# Altium project SENSEI_Base-Board.PrjPcb (part 2 of 3)

## Sheet 06_nRF_POWER_SWD_RF.SchDoc: SENSEI Base Board - nRF Power
size A3; DrawnBy: Sebastian Frey; Organization: Integrated Systems Laboratory; DocumentNumber: 7; Revision: v1.0; SheetNumber: 7; SheetTotal: 12
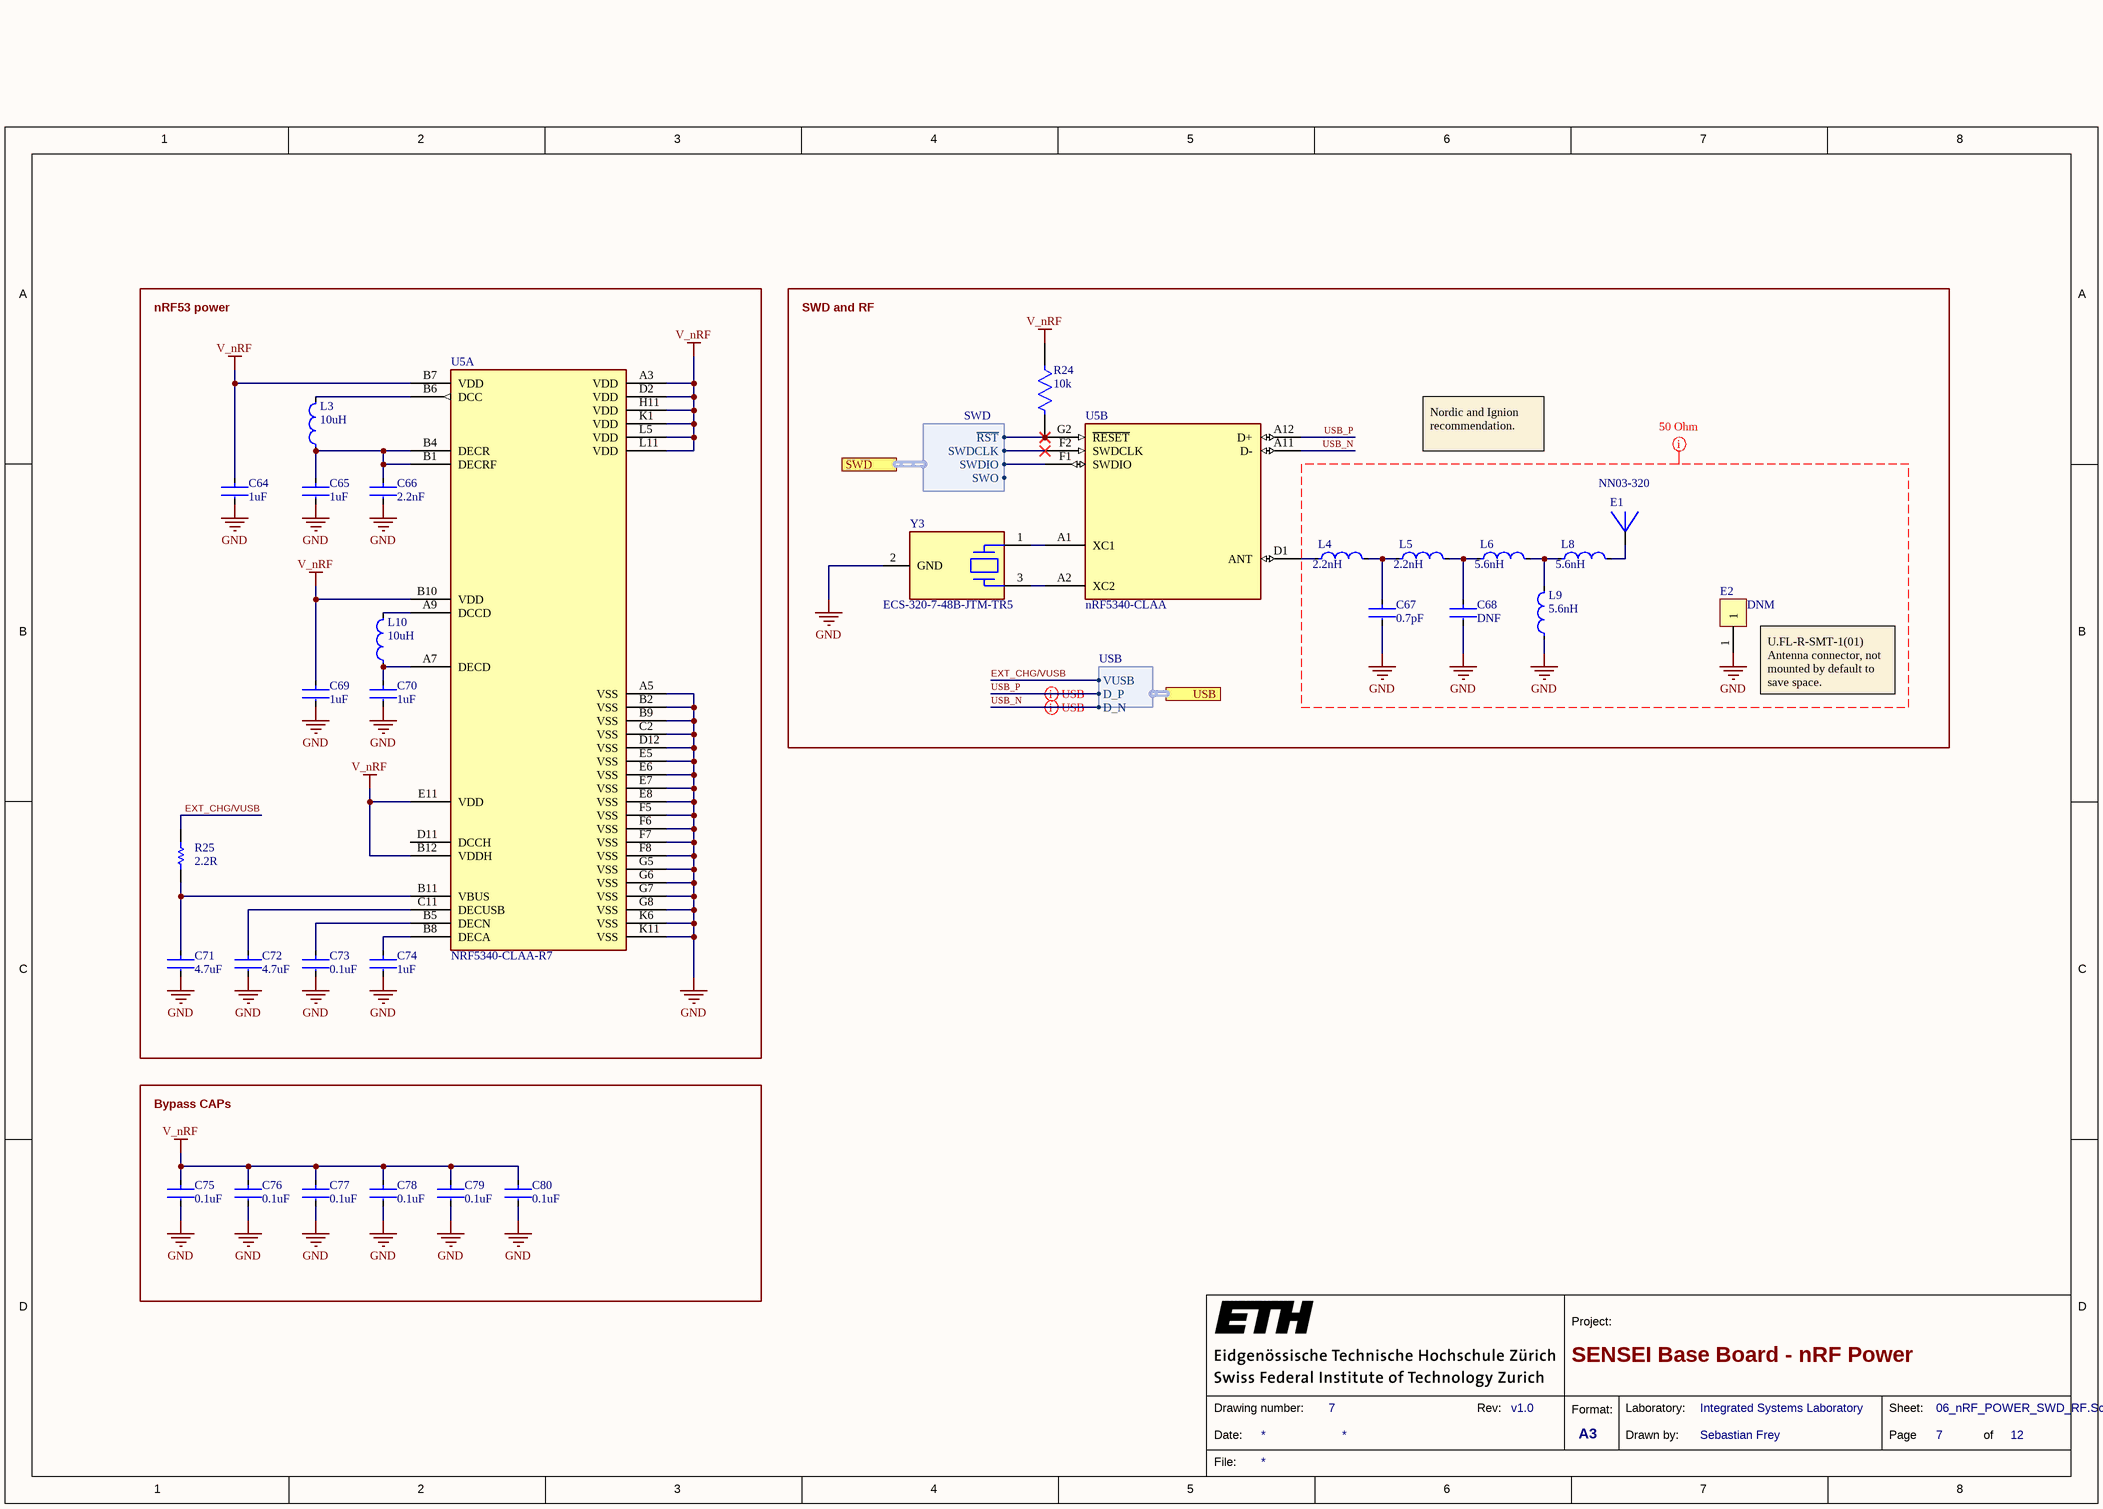
[diagram p6: 06_nRF_POWER_SWD_RF.SchDoc]

### Parts
C64  Capacitance: 1uF  [FP-CL03-IPC_B]  (hidden comment: CL03A105KP3NSNC)
C65  Capacitance: 1uF  [FP-CL03-IPC_B]  (hidden comment: CL03A105KP3NSNC)
C66  Capacitance: 2.2nF  [FP-GRM033-0_03-MFG]  (hidden comment: GRM033R71C222KA88D)
C67  Capacitance: 0.7pF  [FP-GJM033-0_03-IPC_C]  (hidden comment: GJM0335C1ER70BB01D)
C68  DNF  [FP-GRM033-0_03-MFG]
C69  Capacitance: 1uF  [FP-CL03-IPC_B]  (hidden comment: CL03A105KP3NSNC)
C70  Capacitance: 1uF  [FP-CL03-IPC_B]  (hidden comment: CL03A105KP3NSNC)
C71  Capacitance: 4.7uF  [FP-C1005-050-0_15-IPC_B]  (hidden comment: C1005X5R0J475K050BC)
C72  Capacitance: 4.7uF  [FP-C1005-050-0_15-IPC_B]  (hidden comment: C1005X5R0J475K050BC)
C73  Capacitance: 0.1uF  [FP-GRM033-0_03-IPC_B]  (hidden comment: GRM033Z71C104KE14D)
C74  Capacitance: 1uF  [FP-CL03-IPC_B]  (hidden comment: CL03A105KP3NSNC)
C75  Capacitance: 0.1uF  [FP-GRM033-0_03-IPC_B]  (hidden comment: GRM033Z71C104KE14D)
C76  Capacitance: 0.1uF  [FP-GRM033-0_03-IPC_B]  (hidden comment: GRM033Z71C104KE14D)
C77  Capacitance: 0.1uF  [FP-GRM033-0_03-IPC_B]  (hidden comment: GRM033Z71C104KE14D)
C78  Capacitance: 0.1uF  [FP-GRM033-0_03-IPC_B]  (hidden comment: GRM033Z71C104KE14D)
C79  Capacitance: 0.1uF  [FP-GRM033-0_03-IPC_B]  (hidden comment: GRM033Z71C104KE14D)
C80  Capacitance: 0.1uF  [FP-GRM033-0_03-IPC_B]  (hidden comment: GRM033Z71C104KE14D)
E1  NN03-320  [NN03-320]
E2  DNM  [U.FL-R-SMT-1(01)_GND_pad_small]
L3  Parameter 1: 10uH  [FP-LQM18DN_70-IPC_C]  (hidden comment: LQM18DN100M70L)
L4  Inductance: 2.2nH  [FP-LQP03HQ_02-MFG]  (hidden comment: LQP03HQ2N2B02D)
L5  Inductance: 2.2nH  [FP-LQP03HQ_02-MFG]  (hidden comment: LQP03HQ2N2B02D)
L6  Inductance: 5.6nH  [FP-LQW03AW_00-MFG]  (hidden comment: LQW03AW5N6J00D)
L8  Inductance: 5.6nH  [FP-LQW03AW_00-MFG]  (hidden comment: LQW03AW5N6J00D)
L9  Inductance: 5.6nH  [FP-LQW03AW_00-MFG]  (hidden comment: LQW03AW5N6J00D)
L10  Parameter 1: 10uH  [FP-LQM18DN_70-IPC_C]  (hidden comment: LQM18DN100M70L)
R24  Resistance: 10k  [FP-RMCF0201-IPC_C]  (hidden comment: RMCF0201FT10K0)
R25  value 2.2R  [RESC0201(0603)_L]  (hidden comment: RC0201FR-072R2L)
U5  NRF5340-CLAA-R7  [NRF5340_WLCSP]  (parts A,B of 3)
Y3  ECS-320-7-48B-JTM-TR5  [Y_ECX-1048]

### Blocks framed on the sheet
nRF53 power: C64-C66 C69-C74 L3 L10 R25 U5
SWD and RF: C67 C68 E1 E2 L4-L6 L8 L9 R24 U5 Y3
Bypass CAPs: C75-C80

### Ports
SWD (harness SWD), USB (harness USB)

### Harnesses
SWD: ~{RST}, SWDIO, SWDCLK, SWO
USB: VUSB, D_P, D_N

### Nets
GND: C64.2 C65.2 C66.2 C67.2 C68.2 C69.2 C70.2 C71.2 C72.2 C73.2 C74.2 C75.2 C76.2 C77.2 C78.2 C79.2 C80.2 E2.1 L9.1 U5.A5(VSS) U5.B2(VSS) U5.B9(VSS) U5.C2(VSS) U5.D12(VSS) U5.E5(VSS) U5.E6(VSS) U5.E7(VSS) U5.E8(VSS) U5.F5(VSS) U5.F6(VSS) U5.F7(VSS) U5.F8(VSS) U5.G5(VSS) U5.G6(VSS) U5.G7(VSS) U5.G8(VSS) U5.K6(VSS) U5.K11(VSS) Y3.2(GND)
V_nRF: C64.1 C69.1 C75.1 C76.1 C77.1 C78.1 C79.1 C80.1 R24.1 U5.A3(VDD) U5.B7(VDD) U5.B10(VDD) U5.B12(VDDH) U5.D2(VDD) U5.E11(VDD) U5.H11(VDD) U5.K1(VDD) U5.L5(VDD) U5.L11(VDD)
EXT_CHG/VUSB: R25.2 ; port USB.VUSB
~{RST}: R24.2 U5.G2(~{RESET}) ; port SWD.~{RST}
SWDCLK: U5.F2(SWDCLK) ; port SWD.SWDCLK
SWDIO: U5.F1(SWDIO) ; port SWD.SWDIO
USB_N: U5.A11(D-) ; port USB.D_N
USB_P: U5.A12(D+) ; port USB.D_P
NetC65_1: C65.1 C66.1 L3.1 U5.B1(DECRF) U5.B4(DECR)
NetC67_1: C67.1 L4.2 L5.1
NetC68_1: C68.1 L5.2 L6.1
NetC70_1: C70.1 L10.1 U5.A7(DECD)
NetC71_1: C71.1 R25.1 U5.B11(VBUS)
NetC72_1: C72.1 U5.C11(DECUSB)
NetC73_1: C73.1 U5.B5(DECN)
NetC74_1: C74.1 U5.B8(DECA)
NetE1_1: E1.1 L8.2
NetL3_2: L3.2 U5.B6(DCC)
NetL4_1: L4.1 U5.D1(ANT)
NetL6_2: L6.2 L8.1 L9.2
NetL10_2: L10.2 U5.A9(DCCD)
NetU5_A1: U5.A1(XC1) Y3.1
NetU5_A2: U5.A2(XC2) Y3.3

Not connected (* = marked no-connect by the designer): U5 D11(DCCH)

### Layout directives
net class 50OHM: GND
differential pair: USB_N, USB_P

### Notes on the sheet
- Nordic and Ignion recommendation.
- (near E2) U.FL-R-SMT-1(01)
  Antenna connector, not mounted by default to save space.
- 1
- 2
- 3
- 4
- 5
- 6
- 7
- 8
- A
- B
- C
- D
- Project:
- Date:
- Drawing number:
- Rev:
- Format:
- A3
- Drawn by:
- Laboratory:
- Page
- Sheet:
- of
- File:

### Library data of the parts
C64 C65 C69 C70 C74 = CMP-13271-003594-1: as C12 on sheet 00_POWER; Min Operating Temperature: -55°C; Mount: Surface Mount; Packaging: Cut Tape; Width: 0.012inch; Tolerance: 10%; Case Code (Imperial): 0201; Thickness: 0.013inch; Length: 0.024inch; Case/Package: 0201; Max Operating Temperature: 85°C; Voltage Rating: 10V; Case Code (Metric): 0603
C66 = CMP-2010-01694-2: Chip Multilayer Ceramic Capacitors for General Purpose, 0201, 2200pF, X7R, 15%, 10%, 16V; Depth: 0.3mm; Package Quantity: 1; Min Operating Temperature: -55°C; Mount: Surface Mount; Case/Package: 0201; Packaging: Tape and Reel; Case Code (Imperial): 0201; Material: Ceramic; Voltage Rating: 16V; Termination: SMD/SMT; Tolerance: 10%; Case Code (Metric): 0603; Height: 0.3mm; Length: 0.6mm; Voltage Rating (DC): 16V; Width: 0.012inch; Thickness: 0.013inch; Radiation Hardening: No; REACH SVHC: No SVHC; Lead Free: Lead Free; Voltage: 16V; Max Operating Temperature: 125°C; Dielectric: X7R
C67 = CMP-2010-00919-2: Ceramic Capacitor 0.7pF ±0.1pF 25V C0G 0201 (0603 Metric); Width: 0.012inch; Case Code (Metric): 0603; Min Operating Temperature: -55°C; Lead Free: Lead Free; Dielectric: C0G; Packaging: Tape and Reel; Thickness: 0.013inch; Mount: Surface Mount; Radiation Hardening: No; Height: 0.3mm; Voltage Rating (DC): 25V; Case Code (Imperial): 0201; Case/Package: 0201; Package Quantity: 15000; Max Operating Temperature: 125°C; Voltage Rating: 25V; Termination: SMD/SMT; Length: 0.6mm; Depth: 0.3mm
C68 = CMP-06035-035508-1: Case/Package: 0201; Capacitance: DNF
C71 C72 = CMP-2000-05437-2: CAP CER 4.7UF 6.3V X5R 0402 10%; Dielectric Material: Ceramic; Voltage: 6.3V; Depth: 0.5mm; Tolerance: 10%; Height: 0.5mm; Length: 1mm; Termination: SMD/SMT; RoHS Compliant: Yes; Series: C; Case/Package: 0402; Dielectric: X5R; Lead Free: Lead Free; Mount: Surface Mount; Max Operating Temperature: 85°C; Min Operating Temperature: -55°C
C73 C75-C80 = CMP-06035-035508-1: as C19 on sheet 00_POWER; Case/Package: 0201
E1 = NN03-320: Integrated Chip Antenna; Manufacturer: Fractus Antennas; Supplier 1: Mouser; Manufacturer Part Number: NN03-320; Supplier Part Number 1: 128-NN03-320
E2 = U.FL-R-SMT-1(01)_GND_pad
L3 L10 = CMP-06042-017052-1: Multilayer type Inductor for Power Lines 10uH ±20% @1MHz, 300mA, Max DCR 1.365Ω, SRF 32MHz
L4 L5 = CMP-06042-003257-1: Film type RF Inductor 2.2nH ±0.1nH 600mA 0.12Ω 0201 (0603); DC Resistance (DCR): 120mR; Shielding: Unshielded; Core Material: Non-Magnetic; Test Frequency: 500MHz; Self Resonant Frequency: 9GHz; Mount: Surface Mount; Case/Package: 0201; Resistor Type: Thin Film; Max Operating Temperature: 125°C; Packaging: Tape and Reel; Case Code (Imperial): 0201; Case Code (Metric): 0603; Min Operating Temperature: -55°C; Current Rating: 600mA
L6 L8 L9 = CMP-06042-008254-1: Wire Wound RF Inductor 5.6nH ±5% 330mA 0.33Ω 0201 (0603); DC Resistance (DCR): 330mR; Shielding: Unshielded; Core Material: Non-Magnetic; Self Resonant Frequency: 8.3GHz; Test Frequency: 100MHz; Q Factor: 47; Max DC Current: 330mA; Height: 0.4mm; Package Quantity: 10000; Current Rating: 330mA; Max Operating Temperature: 125°C; Packaging: Tape and Reel; Case/Package: Nonstandard; Length: 0.021inch; Mount: Surface Mount; Resistor Type: Wirewound; Tolerance: 5%; Min Operating Temperature: -55°C; Height - Seated (Max): 0.018inch; Termination: SMD/SMT; Width: 0.016inch
R24 = CMP-26527-002755-1: RES 10K OHM 1% 1/20W 0201; Max Power Dissipation: 50mW; Temperature Coefficient: 200ppm/°C; Length: 0.024inch; Min Operating Temperature: -55°C; Width: 0.012inch; Contact Plating: Tin; Case/Package: 0201; Power Rating: 50mW; Packaging: Tape and Reel; Resistor Type: Thick Film; Case Code (Metric): 0603; Tolerance: 1%; Case Code (Imperial): 0201; Max Operating Temperature: 125°C; Height: 0.009inch; Mount: Surface Mount; Series: RMCF; RoHS Compliant: Yes; Number of Terminations: 2
R25 = CMP-1010-00176-1: 2R2 0.05W 1% 0201 (0603 Metric)  SMD; Case-EIA: 0201; Case-Metric: 0603; Technology: SMT; Power: 0.05 W; Tolerance: 1 %
U5 = nRF5340-CLAA: Multi-protocol Bluetooth Low Energy, IEEE 802.15.4, ANT and 2.4GHz proprietary system-on-chip; Manufacturer: Nordic; Supplier 1: Mouser; Supplier Part Number 1: 949-NRF5340-CLAA-R7; Manufacturer Part Number: NRF5340-CLAA-R7
Y3 = Y_ECS-320-7-48B-JTM-TR5: Crystal 32MHz 7pF ±20ppm ±20ppm 4-Pin Ultraminiature CSMD T/R; Manufacturer: ECS International; Manufacturer Part Number: ECS-320-7-48B-JTM-TR5; Supplier 1: Mouser; Supplier Part Number 1: 520-ECS320748BJTMTR5

## Sheet 07_nRF_GPIO.SchDoc: SENSEI Base Board - nRF GPIO
size A3; DrawnBy: Sebastian Frey; Organization: Integrated Systems Laboratory; DocumentNumber: 8; Revision: v1.1; SheetNumber: 8; SheetTotal: 12
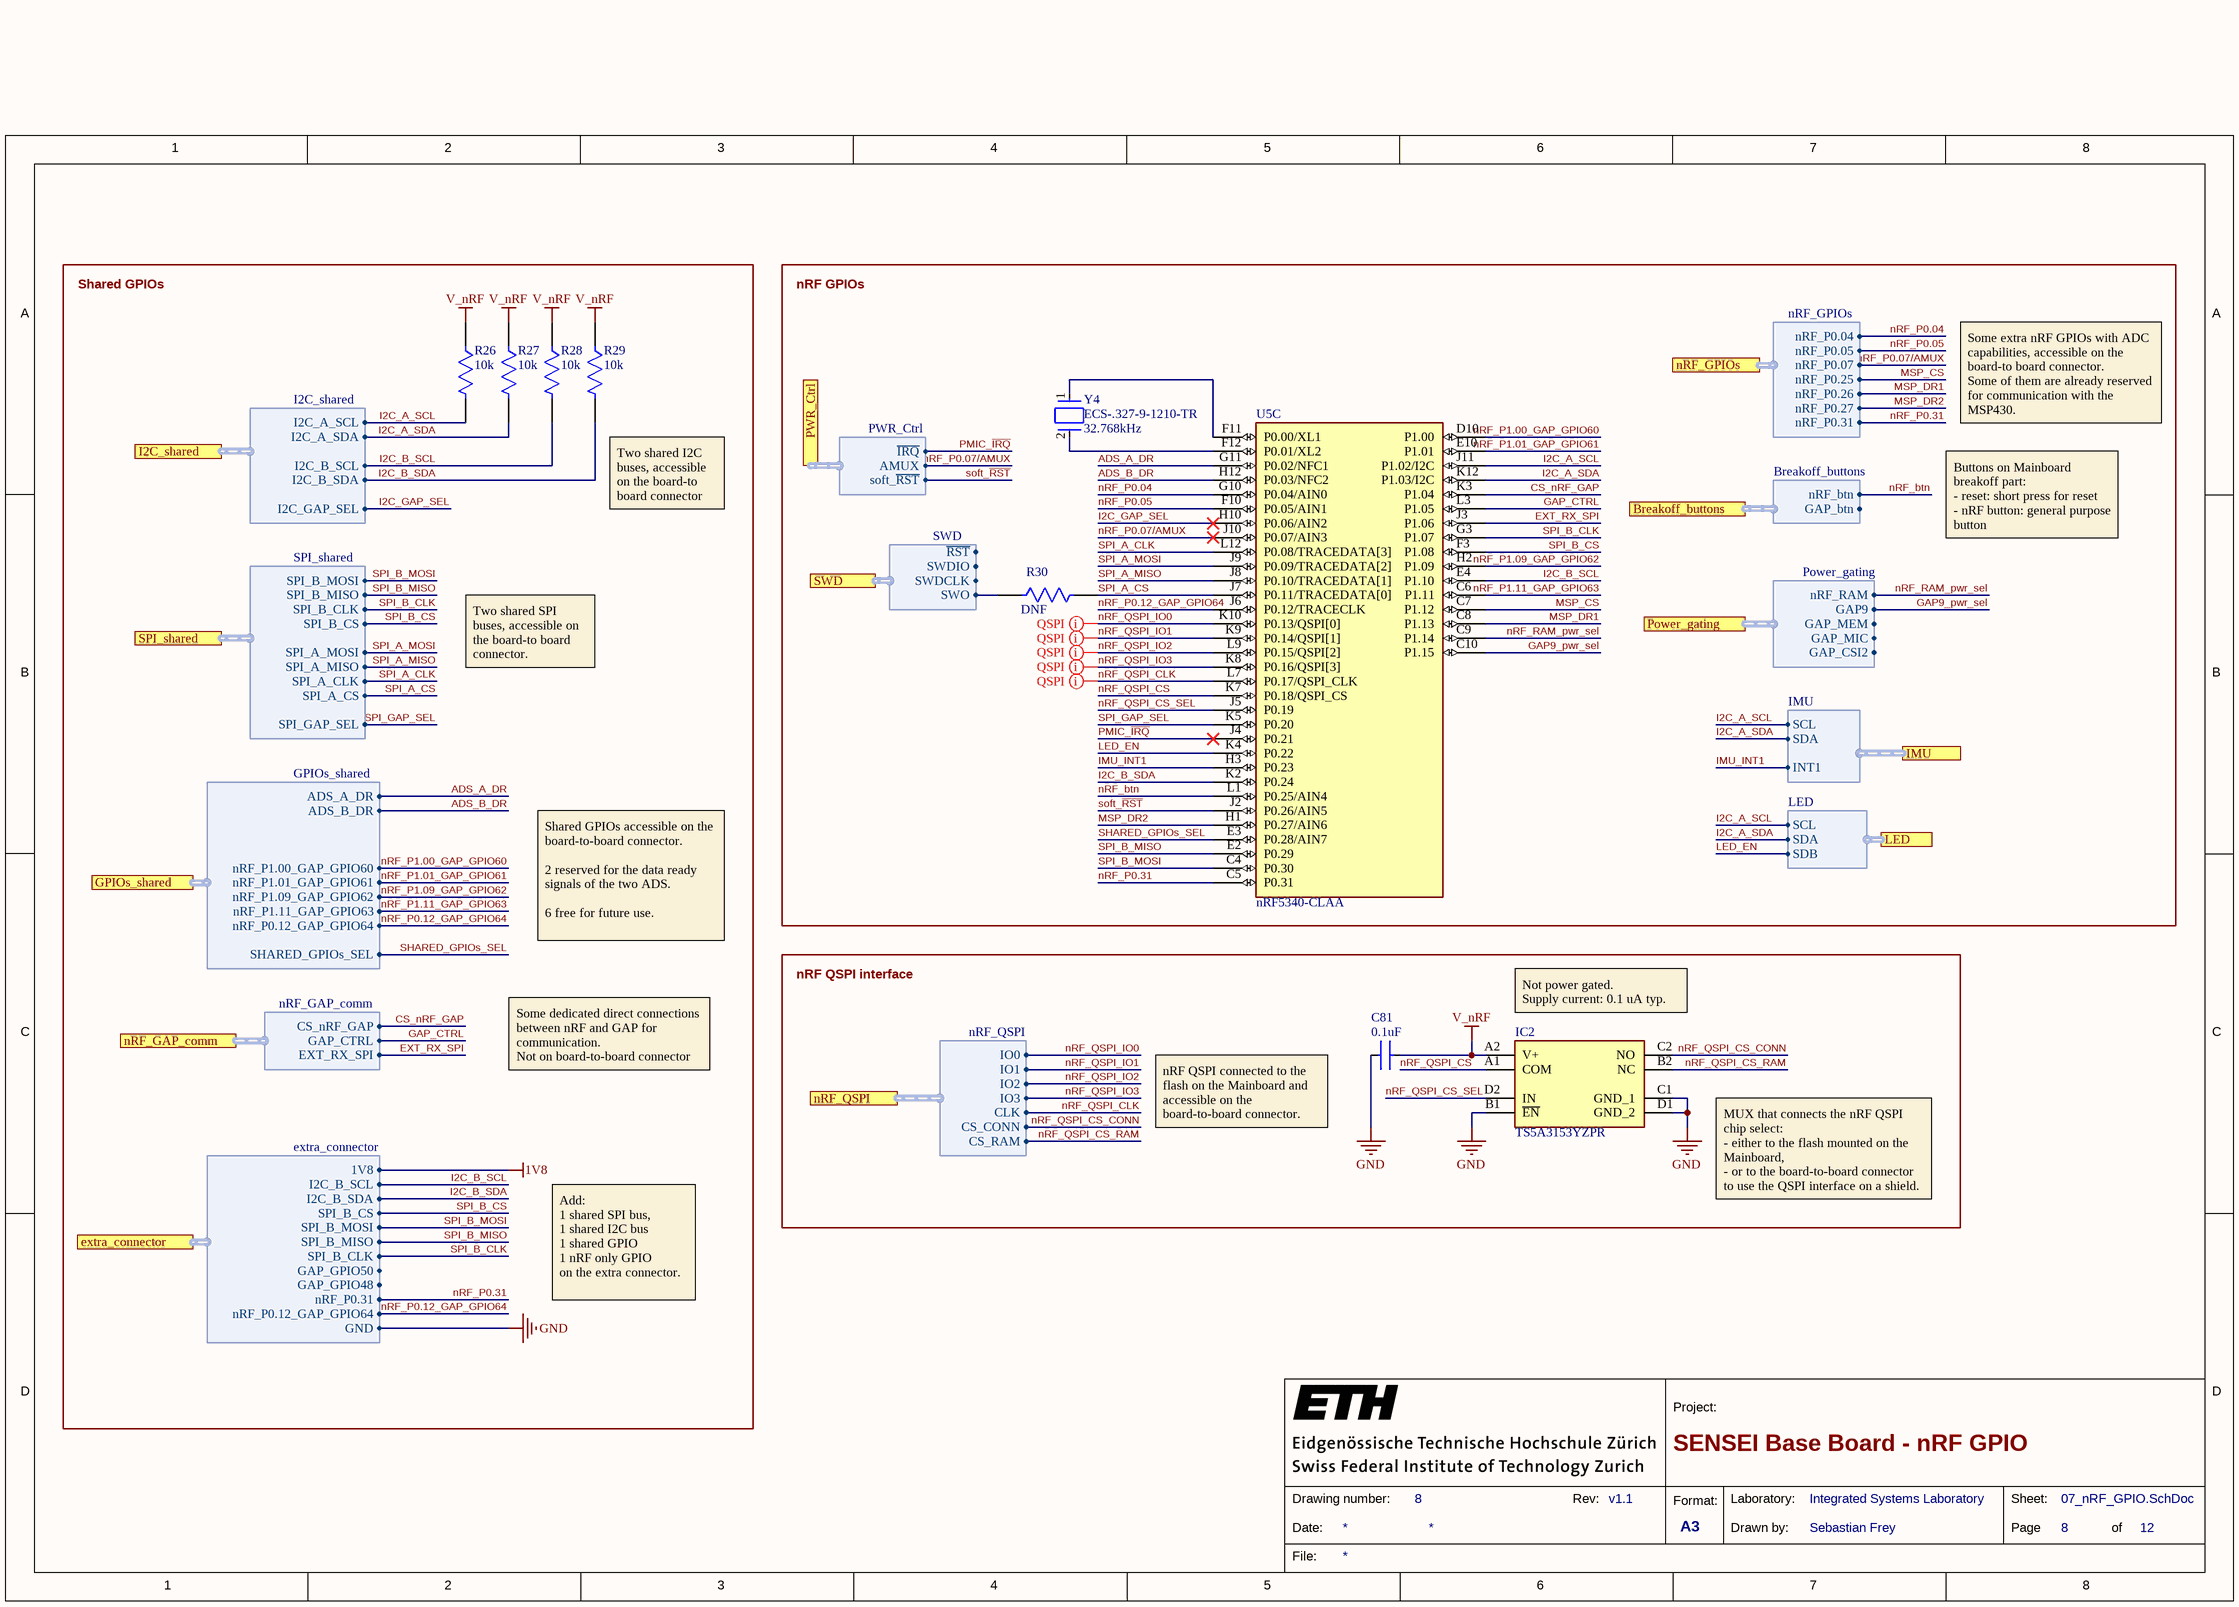
[diagram p7: 07_nRF_GPIO.SchDoc]

### Parts
C81  Capacitance: 0.1uF  [FP-GRM033-0_03-IPC_C]  (hidden comment: GRM033Z71C104KE14D)
IC2  TS5A3153YZPR  [BGA8C50P2X4_89X189X50]
R26  Resistance: 10k  [FP-RMCF0201-IPC_C]  (hidden comment: RMCF0201FT10K0)
R27  Resistance: 10k  [FP-RMCF0201-IPC_C]  (hidden comment: RMCF0201FT10K0)
R28  Resistance: 10k  [FP-RMCF0201-IPC_C]  (hidden comment: RMCF0201FT10K0)
R29  Resistance: 10k  [FP-RMCF0201-IPC_C]  (hidden comment: RMCF0201FT10K0)
R30  DNF  [FP-RMCF0201-IPC_C]
U5  nRF5340-CLAA  [NRF5340_WLCSP]  (part C of 3)
Y4  ECS-.327-9-1210-TR  Frequency: 32.768kHz  [FP-ECX-1210-MFG]

### Blocks framed on the sheet
Shared GPIOs: R26-R29
nRF GPIOs: R30 U5 Y4
nRF QSPI interface: C81 IC2

### Ports
Breakoff_buttons (harness Breakoff_buttons), extra_connector (harness extra_connector), GPIOs_shared (harness GPIOs_shared), I2C_shared (harness I2C_shared), IMU (harness IMU), LED (harness LED), nRF_GAP_comm (harness nRF_GAP_comm), nRF_GPIOs (harness nRF_GPIOs), nRF_QSPI (harness nRF_QSPI), Power_gating (harness Power_gating), PWR_Ctrl (harness PWR_Ctrl), SPI_shared (harness SPI_shared), SWD (harness SWD)

### Harnesses
nRF_QSPI: IO0, IO1, IO2, IO3, CLK, CS_CONN, CS_RAM
LED: SCL, SDA, SDB
SPI_shared: SPI_B_MOSI, SPI_B_MISO, SPI_B_CLK, SPI_B_CS, SPI_A_MOSI, SPI_A_MISO, SPI_A_CLK, SPI_A_CS, SPI_GAP_SEL
I2C_shared: I2C_A_SCL, I2C_A_SDA, I2C_B_SCL, I2C_B_SDA, I2C_GAP_SEL
IMU: SCL, SDA, INT1
Breakoff_buttons: nRF_btn, GAP_btn
nRF_GAP_comm: CS_nRF_GAP, GAP_CTRL, EXT_RX_SPI
GPIOs_shared: ADS_A_DR, ADS_B_DR, nRF_P1.00_GAP_GPIO60, nRF_P1.09_GAP_GPIO62, nRF_P1.11_GAP_GPIO63, nRF_P0.12_GAP_GPIO64, SHARED_GPIOs_SEL, nRF_P1.01_GAP_GPIO61
nRF_GPIOs: nRF_P0.07, nRF_P0.25, nRF_P0.05, nRF_P0.04, nRF_P0.26, nRF_P0.27, nRF_P0.31
extra_connector: SPI_B_CS, SPI_B_MOSI, SPI_B_MISO, SPI_B_CLK, GAP_GPIO50, GAP_GPIO48, I2C_B_SDA, nRF_P0.12_GAP_GPIO64, GND, I2C_B_SCL, 1V8, nRF_P0.31
SWD: ~{RST}, SWDIO, SWDCLK, SWO
Power_gating: nRF_RAM, GAP9, GAP_MEM, GAP_MIC, GAP_CSI2
PWR_Ctrl: ~{IRQ}, AMUX, soft_~{RST}

### Nets
GND: C81.2 IC2.B1(~{EN}) IC2.C1(GND_1) IC2.D1(GND_2) ; port extra_connector.GND
V_nRF: C81.1 IC2.A2(V+) R26.1 R27.1 R28.1 R29.1
ADS_A_DR: U5.G11(P0.02/NFC1) ; port GPIOs_shared.ADS_A_DR
ADS_B_DR: U5.H12(P0.03/NFC2) ; port GPIOs_shared.ADS_B_DR
CS_nRF_GAP: U5.K3(P1.04) ; port nRF_GAP_comm.CS_nRF_GAP
EXT_RX_SPI: U5.J3(P1.06) ; port nRF_GAP_comm.EXT_RX_SPI
GAP9_pwr_sel: U5.C10(P1.15) ; port Power_gating.GAP9
GAP_CTRL: U5.L3(P1.05) ; port nRF_GAP_comm.GAP_CTRL
I2C_A_SCL: R26.2 U5.J11(P1.02/I2C) ; port LED.SCL, port I2C_shared.I2C_A_SCL, port IMU.SCL
I2C_A_SDA: R27.2 U5.K12(P1.03/I2C) ; port LED.SDA, port I2C_shared.I2C_A_SDA, port IMU.SDA
I2C_B_SCL: R28.2 U5.E4(P1.10) ; port I2C_shared.I2C_B_SCL, port extra_connector.I2C_B_SCL
I2C_B_SDA: R29.2 U5.K2(P0.24) ; port I2C_shared.I2C_B_SDA, port extra_connector.I2C_B_SDA
I2C_GAP_SEL: U5.H10(P0.06/AIN2) ; port I2C_shared.I2C_GAP_SEL
IMU_INT1: U5.H3(P0.23) ; port IMU.INT1
LED_EN: U5.K4(P0.22) ; port LED.SDB
MSP_CS: U5.C7(P1.12) ; port nRF_GPIOs.nRF_P0.25
MSP_DR1: U5.C8(P1.13) ; port nRF_GPIOs.nRF_P0.26
MSP_DR2: U5.H1(P0.27/AIN6) ; port nRF_GPIOs.nRF_P0.27
nRF_btn: U5.L1(P0.25/AIN4) ; port Breakoff_buttons.nRF_btn
nRF_P0.04: U5.G10(P0.04/AIN0) ; port nRF_GPIOs.nRF_P0.04
nRF_P0.05: U5.F10(P0.05/AIN1) ; port nRF_GPIOs.nRF_P0.05
nRF_P0.07/AMUX: U5.J10(P0.07/AIN3) ; port nRF_GPIOs.nRF_P0.07, port PWR_Ctrl.AMUX
nRF_P0.12_GAP_GPIO64: U5.J6(P0.12/TRACECLK) ; port GPIOs_shared.nRF_P0.12_GAP_GPIO64, port extra_connector.nRF_P0.12_GAP_GPIO64
nRF_P0.31: U5.C5(P0.31) ; port nRF_GPIOs.nRF_P0.31, port extra_connector.nRF_P0.31
nRF_P1.00_GAP_GPIO60: U5.D10(P1.00) ; port GPIOs_shared.nRF_P1.00_GAP_GPIO60
nRF_P1.01_GAP_GPIO61: U5.E10(P1.01) ; port GPIOs_shared.nRF_P1.01_GAP_GPIO61
nRF_P1.09_GAP_GPIO62: U5.H2(P1.09) ; port GPIOs_shared.nRF_P1.09_GAP_GPIO62
nRF_P1.11_GAP_GPIO63: U5.C6(P1.11) ; port GPIOs_shared.nRF_P1.11_GAP_GPIO63
nRF_QSPI_CLK: U5.L7(P0.17/QSPI_CLK) ; port nRF_QSPI.CLK
nRF_QSPI_CS: IC2.A1(COM) U5.K7(P0.18/QSPI_CS)
nRF_QSPI_CS_CONN: IC2.C2(NO) ; port nRF_QSPI.CS_CONN
nRF_QSPI_CS_RAM: IC2.B2(NC) ; port nRF_QSPI.CS_RAM
nRF_QSPI_CS_SEL: IC2.D2(IN) U5.J5(P0.19)
nRF_QSPI_IO0: U5.K10(P0.13/QSPI[0]) ; port nRF_QSPI.IO0
nRF_QSPI_IO1: U5.K9(P0.14/QSPI[1]) ; port nRF_QSPI.IO1
nRF_QSPI_IO2: U5.L9(P0.15/QSPI[2]) ; port nRF_QSPI.IO2
nRF_QSPI_IO3: U5.K8(P0.16/QSPI[3]) ; port nRF_QSPI.IO3
nRF_RAM_pwr_sel: U5.C9(P1.14) ; port Power_gating.nRF_RAM
PMIC_~{IRQ}: U5.J4(P0.21) ; port PWR_Ctrl.~{IRQ}
SHARED_GPIOs_SEL: U5.E3(P0.28/AIN7) ; port GPIOs_shared.SHARED_GPIOs_SEL
soft_~{RST}: U5.J2(P0.26/AIN5) ; port PWR_Ctrl.soft_~{RST}
SPI_A_CLK: U5.L12(P0.08/TRACEDATA[3]) ; port SPI_shared.SPI_A_CLK
SPI_A_CS: R30.2 U5.J7(P0.11/TRACEDATA[0]) ; port SPI_shared.SPI_A_CS
SPI_A_MISO: U5.J8(P0.10/TRACEDATA[1]) ; port SPI_shared.SPI_A_MISO
SPI_A_MOSI: U5.J9(P0.09/TRACEDATA[2]) ; port SPI_shared.SPI_A_MOSI
SPI_B_CLK: U5.G3(P1.07) ; port SPI_shared.SPI_B_CLK, port extra_connector.SPI_B_CLK
SPI_B_CS: U5.F3(P1.08) ; port SPI_shared.SPI_B_CS, port extra_connector.SPI_B_CS
SPI_B_MISO: U5.E2(P0.29) ; port SPI_shared.SPI_B_MISO, port extra_connector.SPI_B_MISO
SPI_B_MOSI: U5.C4(P0.30) ; port SPI_shared.SPI_B_MOSI, port extra_connector.SPI_B_MOSI
SPI_GAP_SEL: U5.K5(P0.20) ; port SPI_shared.SPI_GAP_SEL
SWO: R30.1 ; port SWD.SWO
NetU5_F11: U5.F11(P0.00/XL1) Y4.1(In/Out)
NetU5_F12: U5.F12(P0.01/XL2) Y4.2(Out/In)

### Layout directives
net class Q_SPI: nRF_QSPI_CLK, nRF_QSPI_IO0, nRF_QSPI_IO1, nRF_QSPI_IO2, nRF_QSPI_IO3

### Notes on the sheet
- Some extra nRF GPIOs with ADC capabilities, accessible on the board-to board connector.
  Some of them are already reserved for communication with the MSP430.
- Two shared I2C buses, accessible on the board-to board connector
- Buttons on Mainboard breakoff part:
  - reset: short press for reset
  - nRF button: general purpose button
- Two shared SPI buses, accessible on the board-to board connector.
- Shared GPIOs accessible on the board-to-board connector.
  2 reserved for the data ready signals of the two ADS.
  6 free for future use.
- (near IC2) Not power gated.
  Supply current: 0.1 uA typ.
- Some dedicated direct connections between nRF and GAP for communication.
  Not on board-to-board connector
- (near C81) nRF QSPI connected to the flash on the Mainboard and accessible on the board-to-board connector.
- MUX that connects the nRF QSPI chip select:
  - either to the flash mounted on the Mainboard,
  - or to the board-to-board connector to use the QSPI interface on a shield.
- Add:
  1 shared SPI bus,
  1 shared I2C bus
  1 shared GPIO
  1 nRF only GPIO
  on the extra connector.
- 1
- 2
- 3
- 4
- 5
- 6
- 7
- 8
- A
- B
- C
- D
- Project:
- Date:
- Drawing number:
- Rev:
- Format:
- A3
- Drawn by:
- Laboratory:
- Page
- Sheet:
- of
- File:

### Library data of the parts
C81 = CMP-06035-035508-1: as C19 on sheet 00_POWER; Case/Package: 0201
IC2 = TS5A3153YZPR: Integrated Circuit; Manufacturer_Name: Texas Instruments; Datasheet Link: http://www.ti.com/lit/gpn/ts5a3153; Height: 0.5mm; Manufacturer_Part_Number: TS5A3153YZPR; Mouser Part Number: 595-TS5A3153YZPR; Mouser Price/Stock: https://www.mouser.co.uk/ProductDetail/Texas-Instruments/TS5A3153YZPR?qs=BBezV1N05%2FtCq%2FSrTOTYog%3D%3D
R26-R29 = CMP-26527-002755-1: as R24 on sheet 06_nRF_POWER_SWD_RF; Length: 0.024inch; Min Operating Temperature: -55°C; Width: 0.012inch; Contact Plating: Tin; Case/Package: 0201; Power Rating: 50mW; Packaging: Tape and Reel; Resistor Type: Thick Film; Case Code (Metric): 0603; Tolerance: 1%; Case Code (Imperial): 0201; Max Operating Temperature: 125°C; Height: 0.009inch; Mount: Surface Mount; Series: RMCF; RoHS Compliant: Yes; Number of Terminations: 2
R30 = CMP-26527-001890-1
U5 = nRF5340-CLAA: Multi-protocol Bluetooth Low Energy, IEEE 802.15.4, ANT and 2.4GHz proprietary system-on-chip; Manufacturer: Nordic; Manufacturer Part Number: NRF5340-CLAA-R7; Supplier 1: Mouser; Supplier Part Number 1: 949-NRF5340-CLAA-R7
Y4 = CMP-40224-000031-1: CRYSTAL 32.7680KHZ 9PF SMD; Frequency Tolerance: 20ppm; ESR (Equivalent Series Resistance): 90kR; Load Capacitance: 9pF; Case/Package: SMD/SMT; Max Operating Temperature: 85°C; Min Operating Temperature: -40°C; Packaging: Tape and Reel; RoHS Compliant: Yes; Mount: Surface Mount

## Sheet 08_nRF_RAM.SchDoc: SENSEI Base Board - nRF RAM
size A3; DrawnBy: Sebastian Frey; Organization: Integrated Systems Laboratory; DocumentNumber: 9; Revision: v1.1; SheetNumber: 9; SheetTotal: 12
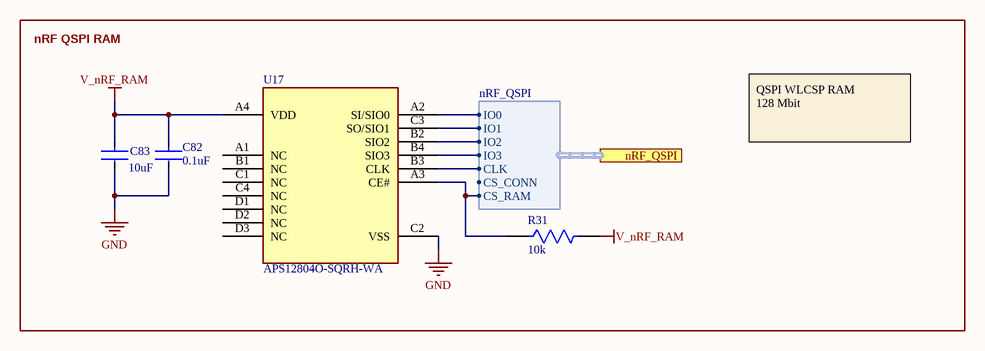
[diagram p8: 08_nRF_RAM.SchDoc]

### Parts
C82  Capacitance: 0.1uF  [FP-GRM033-0_03-IPC_C]  (hidden comment: GRM033Z71C104KE14D)
C83  Capacitance: 10uF  [FP-CL05A106MP5NUNC-IPC_C]  (hidden comment: CL05A106MP5NUNC)
R31  Resistance: 10k  [FP-RMCF0201-IPC_C]  (hidden comment: RMCF0201FT10K0)
U17  APS12804O-SQRH-WA  [APS12804O-SQRH-WA]

### Blocks framed on the sheet
nRF QSPI RAM: C82 C83 R31 U17

### Ports
nRF_QSPI (harness nRF_QSPI)

### Harnesses
nRF_QSPI: IO0, IO1, IO2, IO3, CLK, CS_CONN, CS_RAM

### Nets
GND: C82.2 C83.2 U17.C2(VSS)
V_nRF_RAM: C82.1 C83.1 R31.2 U17.A4(VDD)
nRF_QSPI_CLK: U17.B3(CLK) ; port nRF_QSPI.CLK
nRF_QSPI_CS_RAM: R31.1 U17.A3(CE#) ; port nRF_QSPI.CS_RAM
nRF_QSPI_IO0: U17.A2(SI/SIO0) ; port nRF_QSPI.IO0
nRF_QSPI_IO1: U17.C3(SO/SIO1) ; port nRF_QSPI.IO1
nRF_QSPI_IO2: U17.B2(SIO2) ; port nRF_QSPI.IO2
nRF_QSPI_IO3: U17.B4(SIO3) ; port nRF_QSPI.IO3

Not connected (* = marked no-connect by the designer): U17 A1(NC) B1(NC) C1(NC) C4(NC) D1(NC) D2(NC) D3(NC)

### Notes on the sheet
- QSPI WLCSP RAM
  128 Mbit
- 1
- 2
- 3
- 4
- 5
- 6
- 7
- 8
- A
- B
- C
- D
- Project:
- Date:
- Drawing number:
- Rev:
- Format:
- A3
- Drawn by:
- Laboratory:
- Page
- Sheet:
- of
- File:

### Library data of the parts
C82 = CMP-06035-035508-1: as C19 on sheet 00_POWER; Case/Package: 0201
C83 = CMP-13271-000002-1: as C44 on sheet 00_POWER; Octopart: https://octopart.com/cl05a106mp5nunc-samsung-22457395; Voltage Rating: 10V; RoHS: TRUE; Value: 10uF; Height: 0.7mm; Digikey Description: CAP CER 10UF 10V X5R 0402; Automotive: No; Package: CL05A106MP5NUNC; Device Class L1: Passive Components; Temperature Range High: +85°C; ComponentLink2Description: Datasheet; Device Class L2: Capacitors; Temperature Characteristic: X5R; Manufacturer Part Number: CL05A106MP5NUNC; Temperature: -55°C to +85°C; ComponentLink2URL: http://www.samsungsem.com/kr/support/product-search/mlcc/__icsFiles/afieldfile/2019/05/10/19-CL05A106MP5NUNC.pdf; Device Class L3: Ceramic Capacitors; Category: Cap; Temperature Range Low: -55°C; Ipc Land Pattern Name: CAPC10050X50; Lead Free: Yes
R31 = CMP-26527-002755-1: as R24 on sheet 06_nRF_POWER_SWD_RF; Length: 0.024inch; Min Operating Temperature: -55°C; Width: 0.012inch; Contact Plating: Tin; Case/Package: 0201; Power Rating: 50mW; Packaging: Tape and Reel; Resistor Type: Thick Film; Case Code (Metric): 0603; Tolerance: 1%; Case Code (Imperial): 0201; Max Operating Temperature: 125°C; Height: 0.009inch; Mount: Surface Mount; Series: RMCF; RoHS Compliant: Yes; Number of Terminations: 2
U17 = APS12804O-SQRH-WA: QSPI PSRAM in WLCSP package / 144 MHz / 128 Mbit; Mfr_Name: AP Memory; Manufacturer_Part_Number: APS12804O-SQRH-WA

## Sheet 09_SHARED_PERIPHERAL.SchDoc: SENSEI Base Board - Shared Peripherals
size A3; DrawnBy: Sebastian Frey; Organization: Integrated Systems Laboratory; DocumentNumber: 10; Revision: v1.1; SheetNumber: 10; SheetTotal: 12
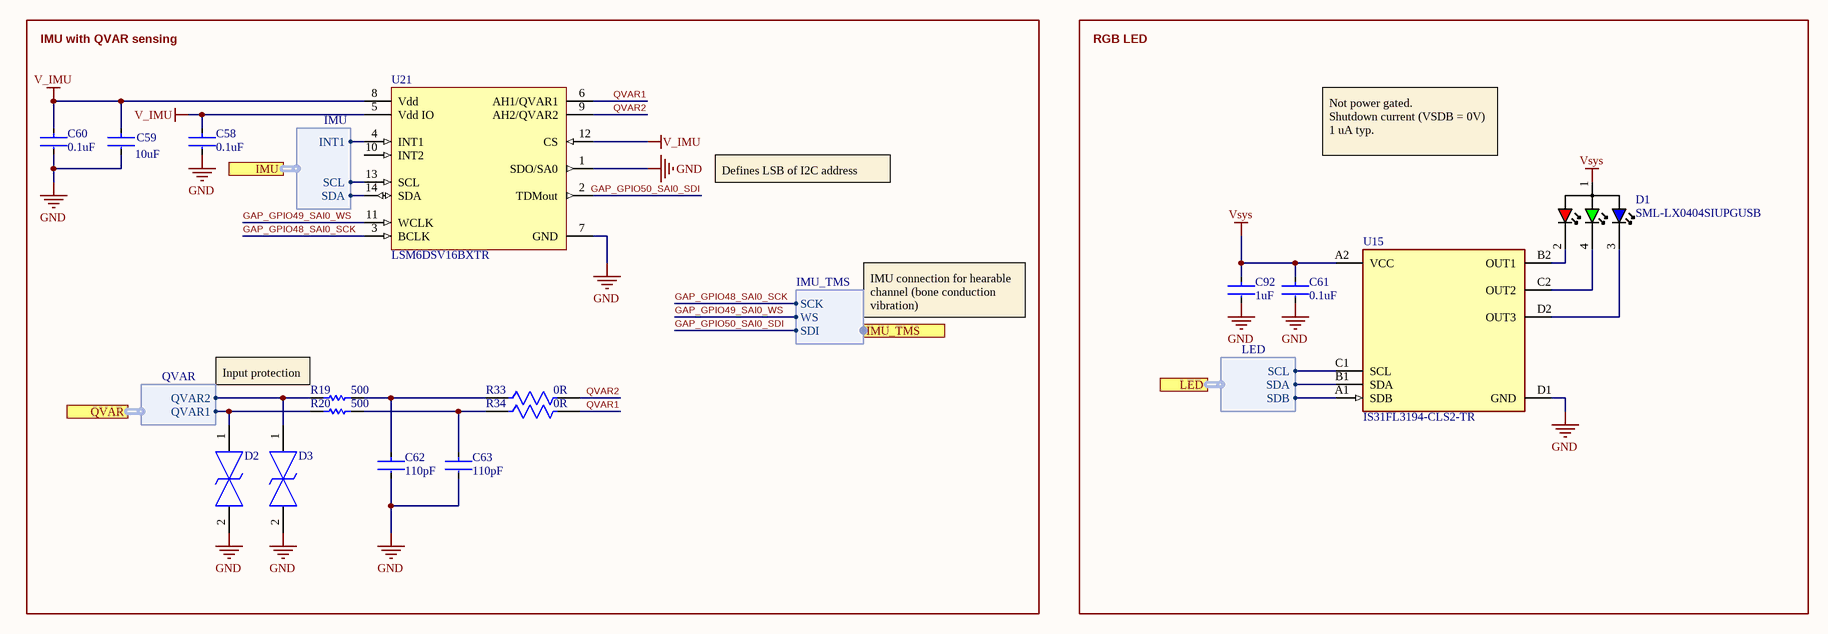
[diagram p9: 09_SHARED_PERIPHERAL.SchDoc]

### Parts
C58  Capacitance: 0.1uF  [FP-GRM033-0_03-IPC_C]  (hidden comment: GRM033Z71C104KE14D)
C59  Capacitance: 10uF  [FP-CL05A106MP5NUNC-IPC_C]  (hidden comment: CL05A106MP5NUNC)
C60  Capacitance: 0.1uF  [FP-GRM033-0_03-IPC_C]  (hidden comment: GRM033Z71C104KE14D)
C61  Capacitance: 0.1uF  [FP-GRM033-0_03-IPC_C]  (hidden comment: GRM033Z71C104KE14D)
C62  Capacitance: 110pF  [FP-GRM033-0_03-IPC_C]  (hidden comment: GRM0335C1H111JA01D)
C63  Capacitance: 110pF  [FP-GRM033-0_03-IPC_C]  (hidden comment: GRM0335C1H111JA01D)
C92  Capacitance: 1uF  [FP-CL03-IPC_C]  (hidden comment: CL03A105KP3NSNC)
D1  SML-LX0404SIUPGUSB  [SML-LX0404SIUPGUSB]
D2  TPD1E01B04DPYRQ1  [TPD1E01B04DPYRQ1]  (value not drawn)
D3  TPD1E01B04DPYRQ1  [TPD1E01B04DPYRQ1]  (value not drawn)
R19  Resistance: 500  [RESC0603X26X15LL03T05]  (hidden comment: ERJ-1GNF4990C)
R20  Resistance: 500  [RESC0603X26X15LL03T05]  (hidden comment: ERJ-1GNF4990C)
R33  Resistance: 0R  [FP-RMCF0402-IPC_C]  (hidden comment: RMCF0402ZT0R00)
R34  Resistance: 0R  [FP-RMCF0402-IPC_C]  (hidden comment: RMCF0402ZT0R00)
U15  IS31FL3194-CLS2-TR  [WLCSP_8_P0.4]
U21  LSM6DSV16BXTR  [FP-LGA-14L-DM00747677-MFG]

### Blocks framed on the sheet
IMU with QVAR sensing: C58-C60 C62 C63 D2 D3 R19 R20 R33 R34 U21
RGB LED: C61 C92 D1 U15

### Ports
IMU (harness IMU), IMU_TMS (harness IMU_TMS), LED (harness LED), QVAR (harness QVAR)

### Harnesses
LED: SCL, SDA, SDB
IMU: SCL, SDA, INT1
QVAR: QVAR2, QVAR1
IMU_TMS: SCK, WS, SDI

### Nets
GND: C58.2 C59.2 C60.2 C61.2 C62.2 C63.2 C92.2 D2.2 D3.2 U15.D1(GND) U21.1(SDO/SA0) U21.7(GND)
V_IMU: C58.1 C59.1 C60.1 U21.5(Vdd_IO) U21.8(Vdd) U21.12(CS)
Vsys: C61.1 C92.1 D1.1(Common_Anode) U15.A2(VCC)
GAP_GPIO48_SAI0_SCK: U21.3(BCLK) ; port IMU_TMS.SCK
GAP_GPIO49_SAI0_WS: U21.11(WCLK) ; port IMU_TMS.WS
GAP_GPIO50_SAI0_SDI: U21.2(TDMout) ; port IMU_TMS.SDI
I2C_A_SCL: U15.C1(SCL) U21.13(SCL) ; port LED.SCL, port IMU.SCL
I2C_A_SDA: U15.B1(SDA) U21.14(SDA) ; port LED.SDA, port IMU.SDA
IMU_INT1: U21.4(INT1) ; port IMU.INT1
LED_EN: U15.A1(SDB) ; port LED.SDB
QVAR1: R34.2 U21.6(AH1/QVAR1)
QVAR2: R33.2 U21.9(AH2/QVAR2)
NetC62_1: C62.1 R19.2 R33.1
NetC63_1: C63.1 R20.2 R34.1
NetD1_2: D1.2(Red_C) U15.B2(OUT1)
NetD1_3: D1.3(Blue_C) U15.D2(OUT3)
NetD1_4: D1.4(Green_C) U15.C2(OUT2)
NetD2_1: D2.1 R20.1 ; port QVAR.QVAR1
NetD3_1: D3.1 R19.1 ; port QVAR.QVAR2

Not connected (* = marked no-connect by the designer): U21 10(INT2)

### Notes on the sheet
- Defines LSB of I2C address
- Not power gated.
  Shutdown current (VSDB = 0V) 1 uA typ.
- IMU connection for hearable channel (bone conduction vibration)
- Input protection
- 1
- 2
- 3
- 4
- 5
- 6
- 7
- 8
- A
- B
- C
- D
- Project:
- Date:
- Drawing number:
- Rev:
- Format:
- A3
- Drawn by:
- Laboratory:
- Page
- Sheet:
- of
- File:

### Library data of the parts
C58 C60 C61 = CMP-06035-035508-1: Chip Multilayer Ceramic Capacitors for General Purpose, 0201, 0.10uF, X7R, 15%, 10%, 16V; Case/Package: 0201
C59 = CMP-13271-000002-1: CAP CER 10UF 10V X5R 0402; Manufacturer: Samsung; Temperature Coefficient: 15%; Tolerance: 20%; Material: Ceramic; Octopart: https://octopart.com/cl05a106mp5nunc-samsung-22457395; Voltage Rating: 10V; RoHS: TRUE; Value: 10uF; Height: 0.7mm; Digikey Description: CAP CER 10UF 10V X5R 0402; Automotive: No; Package: CL05A106MP5NUNC; Device Class L1: Passive Components; Temperature Range High: +85°C; ComponentLink2Description: Datasheet; Device Class L2: Capacitors; Temperature Characteristic: X5R; Manufacturer Part Number: CL05A106MP5NUNC; Temperature: -55°C to +85°C; ComponentLink2URL: http://www.samsungsem.com/kr/support/product-search/mlcc/__icsFiles/afieldfile/2019/05/10/19-CL05A106MP5NUNC.pdf; Device Class L3: Ceramic Capacitors; Category: Cap; Temperature Range Low: -55°C; Ipc Land Pattern Name: CAPC10050X50; Lead Free: Yes
C62 C63 = CMP-06035-019132-1: Chip Multilayer Ceramic Capacitors for General Purpose, 0201, 110pF, C0G, 30ppm/°C, 5%, 50V; Weight: 1.2E-05oz; Case/Package: 0201; Voltage Rating (DC): 50V; Voltage Rating: 50V; Height: 0.3mm; Mount: Surface Mount; Thickness: 0.013inch; Case Code (Metric): 0603; Packaging: Tape and Reel; Case Code (Imperial): 0201; Termination: SMD/SMT; Max Operating Temperature: 125°C; Min Operating Temperature: -55°C; Width: 0.3mm; Dielectric: C0G; Length: 0.024inch; Package Quantity: 1; Tolerance: 5%
C92 = CMP-13271-003594-1: Cap Ceramic 1uF 10V X5R ±10% Pad SMD 0201 +85°C T/R; Min Operating Temperature: -55°C; Mount: Surface Mount; Packaging: Cut Tape; Width: 0.012inch; Tolerance: 10%; Case Code (Imperial): 0201; Thickness: 0.013inch; Length: 0.024inch; Case/Package: 0201; Max Operating Temperature: 85°C; Voltage Rating: 10V; Case Code (Metric): 0603
D1 = D_RGB_LED: SML-LX0404SIUPGUSB RGB LED; Manufacturer: Lumex; Supplier 1: Mouser; Manufacturer Part Number: SML-LX0404SIUPGUSB; Supplier Part Number 1: 696-LX0404SIUPGUSB
D2 D3 = TPD1E01B04DPYRQ1: TVS Diode (Bi-directional); Manufacturer_Name: Texas Instruments; Datasheet Link: https://www.ti.com/lit/ds/symlink/tpd1e01b04-q1.pdf?ts=1677834076075&ref_url=https%253A%252F%252Fwww.ti.com%252Fproduct%252FTPD1E01B04-Q1%252Fpart-details%252FTPD1E01B04DPYRQ1; Height: 0.45mm; Manufacturer_Part_Number: TPD1E01B04DPYRQ1; Mouser Part Number: 595-TPD1E01B04DPYRQ1; Mouser Price/Stock: https://www.mouser.co.uk/ProductDetail/Texas-Instruments/TPD1E01B04DPYRQ1?qs=doiCPypUmgEwTnvBpZhkOw%3D%3D; Arrow Part Number: TPD1E01B04DPYRQ1; Arrow Price/Stock: https://www.arrow.com/en/products/tpd1e01b04dpyrq1/texas-instruments?region=nac
R19 R20 = CMP-2004-03369-1: Manufacturer: Panasonic; Part Number: ERJ-1GNF4990C
R33 R34 = CMP-26527-007617-1: RES 0 OHM JUMPER 1/16W 0402; Power Rating: 63mW; Working Voltage: 50V; Current Rating: 1A; Series: RMCF; RoHS Compliant: Yes; Features: Automotive AEC-Q200; Width: 0.02inch; Depth: 0.5mm; Resistor Type: Thick Film; Number of Terminations: 2; Radiation Hardening: No; Length: 0.039inch; Contact Plating: Tin; Case/Package: 0402; Min Operating Temperature: -55°C; Case Code (Metric): 1005; Construction: Rectangular; Mount: Surface Mount; Max Operating Temperature: 155°C; Max Power Dissipation: 63mW; Height: 0.016inch; Lead Free: Lead Free; Packaging: Tape and Reel; Technology: THICK FILM; Case Code (Imperial): 0402; Military Standard: Not
U15 = IS31FL3194: LED Driver with Programmable Pattern Sequencing 3-Channel 40mA 8-Pin WCSP T/R; Manufacturer: ISSI; Supplier 1: Digi-Key; Manufacturer Part Number: IS31FL3194-CLS2-TR; Supplier Part Number 1: 2521-IS31FL3194-CLS2-TRCT-ND
U21 = CMP-00355-129901550-1: LSM6DSV16BXTR Inemo Inertial Module, 3.6V, Smd, Mems Module FunctionTri-Axis Gyroscope; Min Supply Voltage: 1.08V; Operating Supply Current: 950µA; NexarPartId: 129901550; Min Operating Temperature: -40°C; Max Supply Voltage: 3.6V; Height: 740µm; Max Operating Temperature: 85°C

## Sheet 10_CONNECTOR.SchDoc: SENSEI Base Board - Connectors
size A3; DrawnBy: Sebastian Frey; Organization: Integrated Systems Laboratory; DocumentNumber: 11; Revision: v1.1; SheetNumber: 11; SheetTotal: 12
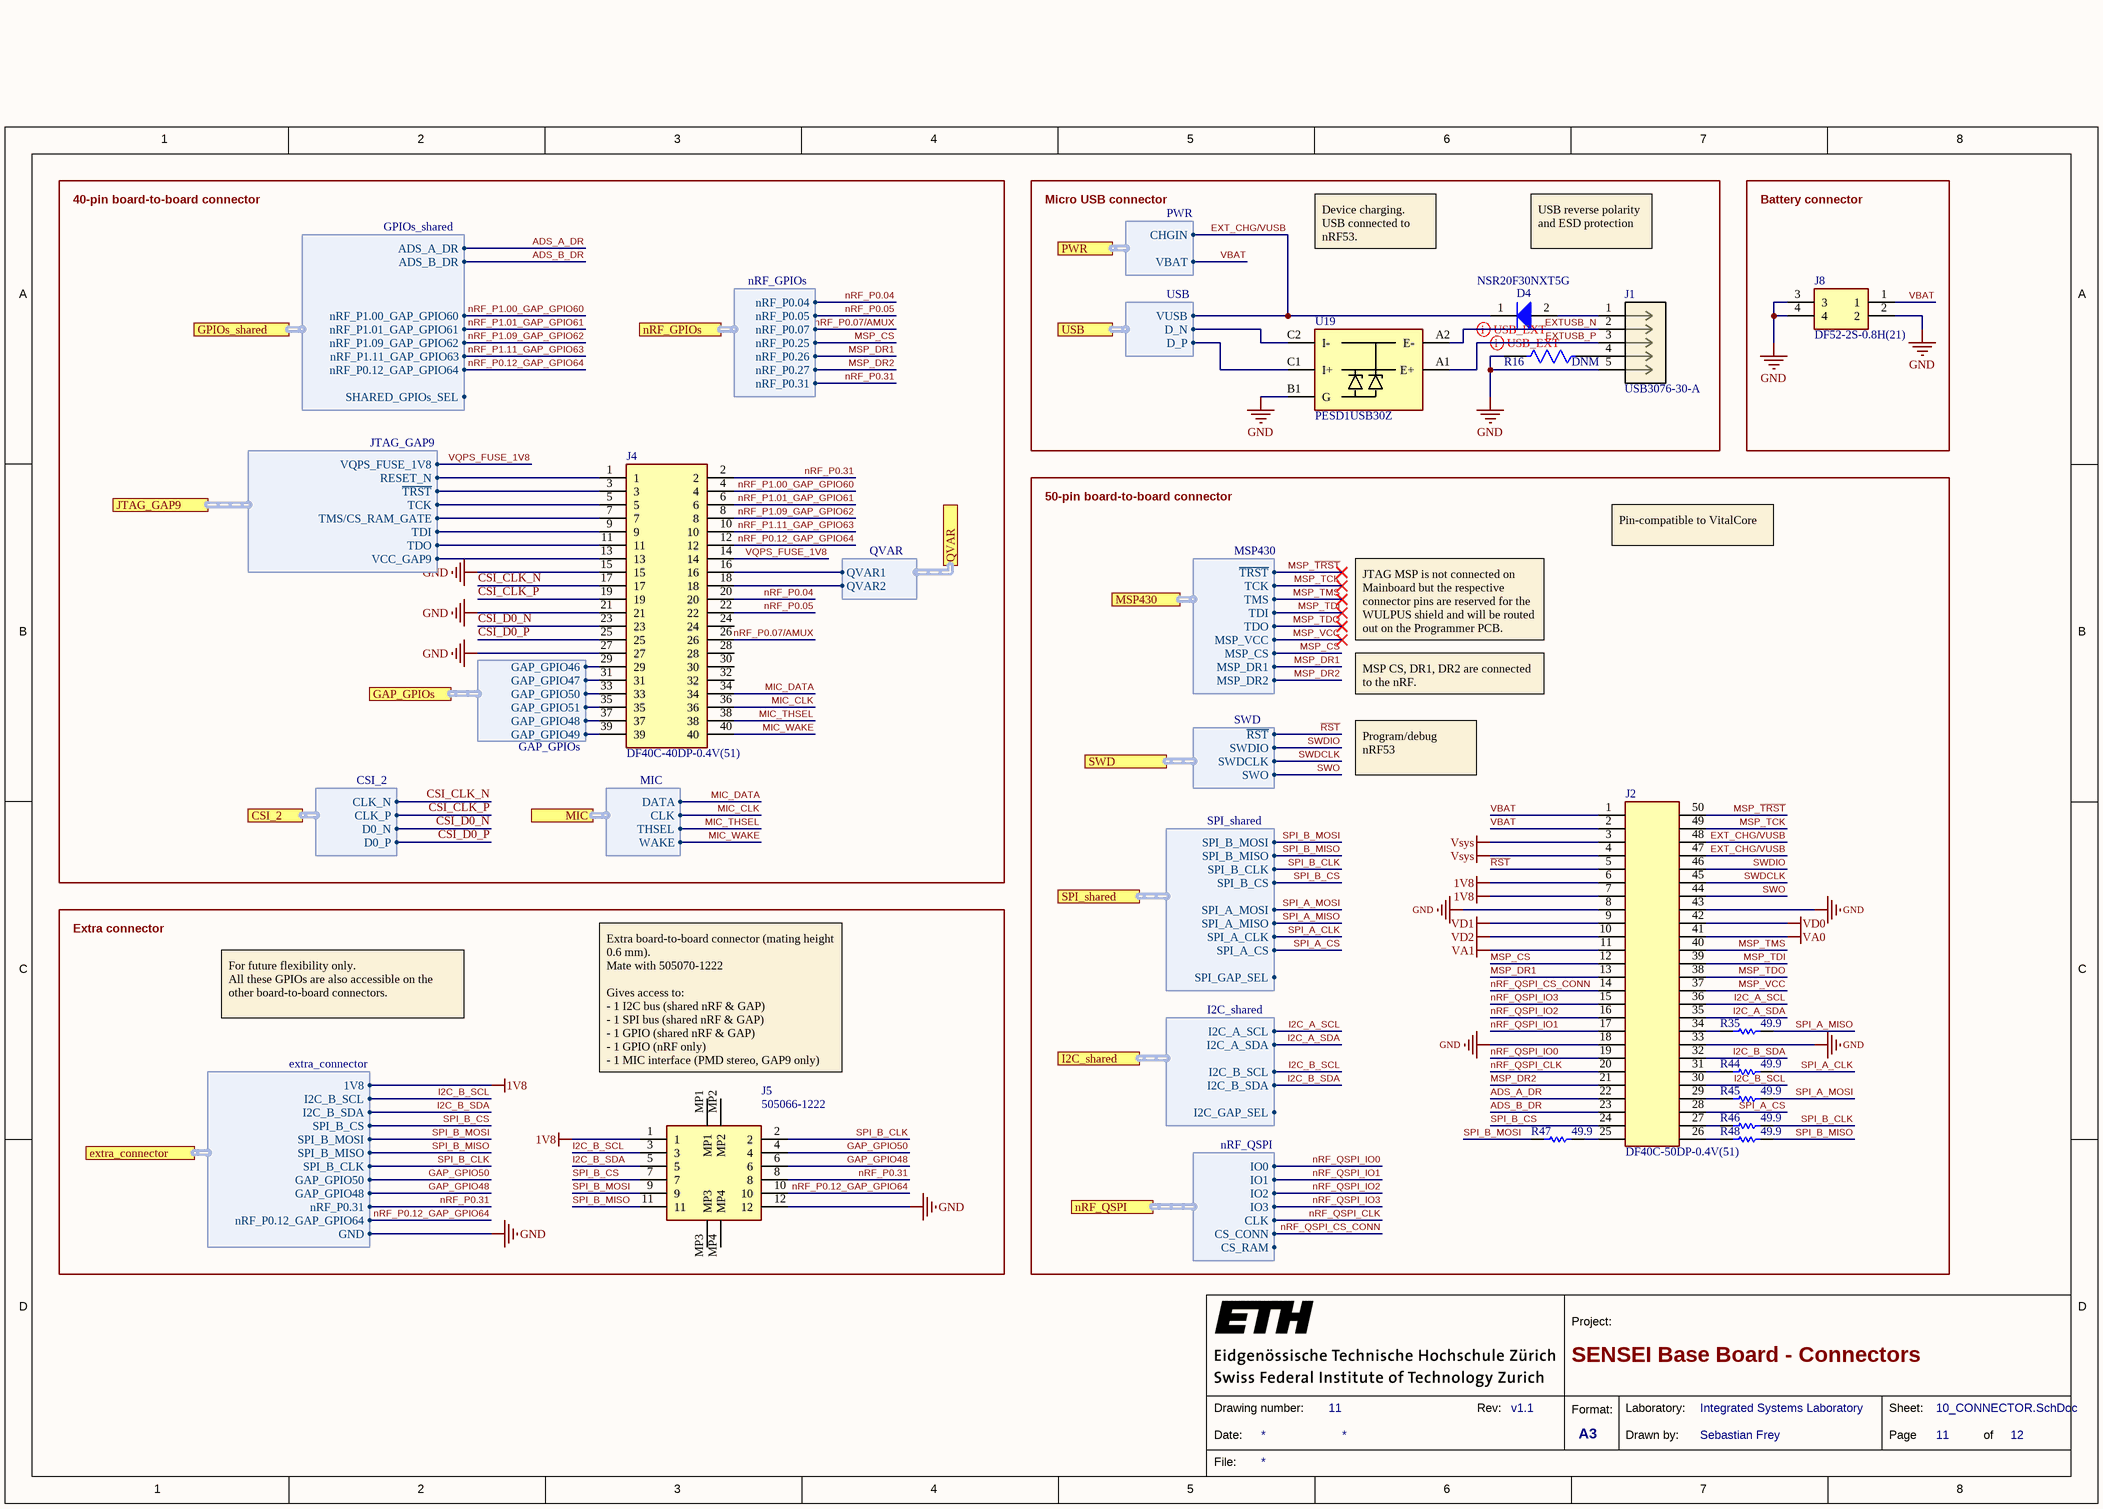
[diagram p10: 10_CONNECTOR.SchDoc]

### Parts
D4  NSR20F30NXT5G  [ONSC-DSN-2-512AB-01_V]
J1  USB3076-30-A  [CONN_USB3076-30-A_GCT]
J2  DF40C-50DP-0.4V(51)  [CONN_COMBI_50P]
J4  DF40C-40DP-0.4V(51)  [FP-DF40C-40DP-0_4V_51-MFG]
J5  505066-1222  [5050661222]
J8  DF52-2S-0.8H(21)  [DF522S08H21]
R16  DNM  [0201]
R35  Resistance: 49.9  [RESC0603X28X15ML05T05]  (hidden comment: CRCW020149R9FNED)
R44  Resistance: 49.9  [RESC0603X28X15ML05T05]  (hidden comment: CRCW020149R9FNED)
R45  Resistance: 49.9  [RESC0603X28X15ML05T05]  (hidden comment: CRCW020149R9FNED)
R46  Resistance: 49.9  [RESC0603X28X15ML05T05]  (hidden comment: CRCW020149R9FNED)
R47  Resistance: 49.9  [RESC0603X28X15ML05T05]  (hidden comment: CRCW020149R9FNED)
R48  Resistance: 49.9  [RESC0603X28X15ML05T05]  (hidden comment: CRCW020149R9FNED)
U19  PESD1USB30Z  [WLCSP_5_2-1-2_P0.4]

### Blocks framed on the sheet
40-pin board-to-board connector: J4
Micro USB connector: D4 J1 R16 U19
Battery connector: J8
50-pin board-to-board connector: J2 R35 R44-R48
Extra connector: J5

### Ports
CSI_2 (harness CSI_2), extra_connector (harness extra_connector), GAP_GPIOs (harness GAP_GPIOs), GPIOs_shared (harness GPIOs_shared), I2C_shared (harness I2C_shared), JTAG_GAP9 (harness JTAG_GAP9), MIC (harness MIC), MSP430 (harness MSP430), nRF_GPIOs (harness nRF_GPIOs), nRF_QSPI (harness nRF_QSPI), PWR (harness PWR), QVAR (harness QVAR), SPI_shared (harness SPI_shared), SWD (harness SWD), USB (harness USB)

### Harnesses
SWD: ~{RST}, SWDIO, SWDCLK, SWO
nRF_QSPI: IO0, IO1, IO2, IO3, CLK, CS_CONN, CS_RAM
SPI_shared: SPI_B_MOSI, SPI_B_MISO, SPI_B_CLK, SPI_B_CS, SPI_A_MOSI, SPI_A_MISO, SPI_A_CLK, SPI_A_CS, SPI_GAP_SEL
I2C_shared: I2C_A_SCL, I2C_A_SDA, I2C_B_SCL, I2C_B_SDA, I2C_GAP_SEL
QVAR: QVAR2, QVAR1
MSP430: ~{TRST}, TCK, TMS, TDI, TDO, MSP_VCC, MSP_DR1, MSP_DR2, MSP_CS
USB: VUSB, D_P, D_N
PWR: CHGIN, VBAT
MIC: DATA, THSEL, WAKE, CLK
GAP_GPIOs: GAP_GPIO46, GAP_GPIO47, GAP_GPIO50, GAP_GPIO51, GAP_GPIO48, GAP_GPIO49
GPIOs_shared: ADS_A_DR, ADS_B_DR, nRF_P1.00_GAP_GPIO60, nRF_P1.09_GAP_GPIO62, nRF_P1.11_GAP_GPIO63, nRF_P0.12_GAP_GPIO64, SHARED_GPIOs_SEL, nRF_P1.01_GAP_GPIO61
nRF_GPIOs: nRF_P0.07, nRF_P0.25, nRF_P0.05, nRF_P0.04, nRF_P0.26, nRF_P0.27, nRF_P0.31
CSI_2: CLK_N, CLK_P, D0_P, D0_N
extra_connector: SPI_B_CS, SPI_B_MOSI, SPI_B_MISO, SPI_B_CLK, GAP_GPIO50, GAP_GPIO48, I2C_B_SDA, nRF_P0.12_GAP_GPIO64, GND, I2C_B_SCL, 1V8, nRF_P0.31
JTAG_GAP9: ~{TRST}, TCK, TMS/CS_RAM_GATE, TDI, TDO, VCC_GAP9, RESET_N, VQPS_FUSE_1V8

### Nets
1V8: J2.6 J2.7 J5.1 ; port extra_connector.1V8
GND: J1.5 J2.8 J2.18 J2.33 J2.43 J4.15 J4.21 J4.27 J5.12 J8.2 J8.3 J8.4 R16.2 U19.B1(G) ; port extra_connector.GND
V_GAP9: J4.13 ; port JTAG_GAP9.VCC_GAP9
VA0: J2.41
VA1: J2.11
VD0: J2.42
VD1: J2.9
VD2: J2.10
Vsys: J2.3 J2.4
ADS_A_DR: J2.22 ; port GPIOs_shared.ADS_A_DR
ADS_B_DR: J2.23 ; port GPIOs_shared.ADS_B_DR
CSI_CLK_N: J4.17 ; port CSI_2.CLK_N
CSI_CLK_P: J4.19 ; port CSI_2.CLK_P
CSI_D0_N: J4.23 ; port CSI_2.D0_N
CSI_D0_P: J4.25 ; port CSI_2.D0_P
EXT_CHG/VUSB: D4.1(K) J2.47 J2.48 ; port USB.VUSB, port PWR.CHGIN
EXTUSB_N: J1.2 U19.A2(E-)
EXTUSB_P: J1.3 U19.A1(E+)
GAP_GPIO46: J4.29 ; port GAP_GPIOs.GAP_GPIO46
GAP_GPIO47: J4.31 ; port GAP_GPIOs.GAP_GPIO47
GAP_GPIO48: J4.37 J5.6 ; port GAP_GPIOs.GAP_GPIO48, port extra_connector.GAP_GPIO48
GAP_GPIO49: J4.39 ; port GAP_GPIOs.GAP_GPIO49
GAP_GPIO50: J4.33 J5.4 ; port GAP_GPIOs.GAP_GPIO50, port extra_connector.GAP_GPIO50
GAP_GPIO51: J4.35 ; port GAP_GPIOs.GAP_GPIO51
I2C_A_SCL: J2.36 ; port I2C_shared.I2C_A_SCL
I2C_A_SDA: J2.35 ; port I2C_shared.I2C_A_SDA
I2C_B_SCL: J2.30 J5.3 ; port I2C_shared.I2C_B_SCL, port extra_connector.I2C_B_SCL
I2C_B_SDA: J2.32 J5.5 ; port I2C_shared.I2C_B_SDA, port extra_connector.I2C_B_SDA
JTAG_~{TRST}: J4.3 ; port JTAG_GAP9.~{TRST}
JTAG_TCK: J4.5 ; port JTAG_GAP9.TCK
JTAG_TDI: J4.9 ; port JTAG_GAP9.TDI
JTAG_TDO: J4.11 ; port JTAG_GAP9.TDO
JTAG_TMS/CS_RAM_GATE: J4.7 ; port JTAG_GAP9.TMS/CS_RAM_GATE
MIC_CLK: J4.36 ; port MIC.CLK
MIC_DATA: J4.34 ; port MIC.DATA
MIC_THSEL: J4.38 ; port MIC.THSEL
MIC_WAKE: J4.40 ; port MIC.WAKE
MSP_CS: J2.12 ; port MSP430.MSP_CS, port nRF_GPIOs.nRF_P0.25
MSP_DR1: J2.13 ; port MSP430.MSP_DR1, port nRF_GPIOs.nRF_P0.26
MSP_DR2: J2.21 ; port MSP430.MSP_DR2, port nRF_GPIOs.nRF_P0.27
MSP_~{TRST}: J2.50 ; port MSP430.~{TRST}
MSP_TCK: J2.49 ; port MSP430.TCK
MSP_TDI: J2.39 ; port MSP430.TDI
MSP_TDO: J2.38 ; port MSP430.TDO
MSP_TMS: J2.40 ; port MSP430.TMS
MSP_VCC: J2.37 ; port MSP430.MSP_VCC
nRF_P0.04: J4.20 ; port nRF_GPIOs.nRF_P0.04
nRF_P0.05: J4.22 ; port nRF_GPIOs.nRF_P0.05
nRF_P0.07/AMUX: J4.26 ; port nRF_GPIOs.nRF_P0.07
nRF_P0.12_GAP_GPIO64: J4.12 J5.10 ; port GPIOs_shared.nRF_P0.12_GAP_GPIO64, port extra_connector.nRF_P0.12_GAP_GPIO64
nRF_P0.31: J4.2 J5.8 ; port nRF_GPIOs.nRF_P0.31, port extra_connector.nRF_P0.31
nRF_P1.00_GAP_GPIO60: J4.4 ; port GPIOs_shared.nRF_P1.00_GAP_GPIO60
nRF_P1.01_GAP_GPIO61: J4.6 ; port GPIOs_shared.nRF_P1.01_GAP_GPIO61
nRF_P1.09_GAP_GPIO62: J4.8 ; port GPIOs_shared.nRF_P1.09_GAP_GPIO62
nRF_P1.11_GAP_GPIO63: J4.10 ; port GPIOs_shared.nRF_P1.11_GAP_GPIO63
nRF_QSPI_CLK: J2.20 ; port nRF_QSPI.CLK
nRF_QSPI_CS_CONN: J2.14 ; port nRF_QSPI.CS_CONN
nRF_QSPI_IO0: J2.19 ; port nRF_QSPI.IO0
nRF_QSPI_IO1: J2.17 ; port nRF_QSPI.IO1
nRF_QSPI_IO2: J2.16 ; port nRF_QSPI.IO2
nRF_QSPI_IO3: J2.15 ; port nRF_QSPI.IO3
~{RST}: J2.5 ; port SWD.~{RST}
RESET_N: J4.1 ; port JTAG_GAP9.RESET_N
SPI_A_CLK: R44.2 ; port SPI_shared.SPI_A_CLK
SPI_A_CS: J2.28 ; port SPI_shared.SPI_A_CS
SPI_A_MISO: R35.2 ; port SPI_shared.SPI_A_MISO
SPI_A_MOSI: R45.2 ; port SPI_shared.SPI_A_MOSI
SPI_B_CLK: J5.2 R46.2 ; port SPI_shared.SPI_B_CLK, port extra_connector.SPI_B_CLK
SPI_B_CS: J2.24 J5.7 ; port SPI_shared.SPI_B_CS, port extra_connector.SPI_B_CS
SPI_B_MISO: J5.11 R48.2 ; port SPI_shared.SPI_B_MISO, port extra_connector.SPI_B_MISO
SPI_B_MOSI: J5.9 R47.1 ; port SPI_shared.SPI_B_MOSI, port extra_connector.SPI_B_MOSI
SWDCLK: J2.45 ; port SWD.SWDCLK
SWDIO: J2.46 ; port SWD.SWDIO
SWO: J2.44 ; port SWD.SWO
USB_N: U19.C2(I-) ; port USB.D_N
USB_P: U19.C1(I+) ; port USB.D_P
VBAT: J2.1 J2.2 J8.1 ; port PWR.VBAT
VQPS_FUSE_1V8: J4.14 ; port JTAG_GAP9.VQPS_FUSE_1V8
NetD2_1: J4.16 ; port QVAR.QVAR1
NetD3_1: J4.18 ; port QVAR.QVAR2
NetD4_2: D4.2(A) J1.1
NetJ1_4: J1.4 R16.1
NetJ2_25: J2.25 R47.2
NetJ2_26: J2.26 R48.1
NetJ2_27: J2.27 R46.1
NetJ2_29: J2.29 R45.1
NetJ2_31: J2.31 R44.1
NetJ2_34: J2.34 R35.1

Not connected (* = marked no-connect by the designer): J4 24 28 30 32; J5 MP1 MP2 MP3 MP4

### Layout directives
differential pair: EXTUSB_N, EXTUSB_P

### Notes on the sheet
- Device charging.
  USB connected to nRF53.
- USB reverse polarity and ESD protection
- Pin-compatible to VitalCore
- JTAG MSP is not connected on Mainboard but the respective connector pins are reserved for the WULPUS shield and will be routed out on the Programmer PCB.
- MSP CS, DR1, DR2 are connected to the nRF.
- Program/debug nRF53
- For future flexibility only.
  All these GPIOs are also accessible on the other board-to-board connectors.
- Extra board-to-board connector (mating height 0.6 mm).
  Mate with 505070-1222
  Gives access to:
  - 1 I2C bus (shared nRF & GAP)
  - 1 SPI bus (shared nRF & GAP)
  - 1 GPIO (shared nRF & GAP)
  - 1 GPIO (nRF only)
  - 1 MIC interface (PMD stereo, GAP9 only)
- 1
- 2
- 3
- 4
- 5
- 6
- 7
- 8
- A
- B
- C
- D
- Project:
- Date:
- Drawing number:
- Rev:
- Format:
- A3
- Drawn by:
- Laboratory:
- Page
- Sheet:
- of
- File:

### Library data of the parts
D4 = CMP-1055-00233-1: Schottky Barrier Diode, 2-Pin DSN, Pb-Free, Tape and Reel; Manufacturer: On Semiconductor; IFSM Max (A): 28; Configuration: Single; ComponentLink2URL: http://www.onsemi.com/pub_link/Collateral/NSR20F30-D.PDF; ComponentLink1URL: http://www.onsemi.com/; ComponentLink2Description: Datasheet; PackageVersion: Rev. B, 01/2011; Mounting Technology: Surface Mount; DatasheetVersion: Rev. 3; Packing: Tape and Reel; PartNumber: NSR20F30NXT5G; ComponentLink3Description: Package Specification; RoHS: TRUE; PackageDescription: 2-Pin Micro Molded Package, Body 1.6 x 0.8 mm; ComponentLink3URL: http://www.onsemi.cn/pub_link/Collateral/152AB.PDF; ComponentLink1Description: Manufacturer URL; PackageReference: DSN-2-512AB-01
J1 = USB3076-30-A: No Description Available; Mfr_Name: Global Connector Technology; Copyright: Copyright (C) 2023 Ultra Librarian. All rights reserved.; Manufacturer_Part_Number: USB3076-30-A; RefDes: RefDes; Type: DEV
J2 = CONN_50P_M_COMBI_INTERFACE: 50Pin 0.4mm pitch connector footprint that accepts (male) connectors intended for different stacking heights: / Hirose - DF40C-50DP-0.4V(51) for 1.5mm - 3mm stacking height / JAE - WP7B-P050VA1-R8000 - for 0.7mm stacking height
J4 = DF40C-40DP-0.4V(51): CONN PLUG 40POS SMD GOLD; Number of Contacts: 40; Gender: Male; Voltage Rating: 30V; Mated Stacking Heights: 4mm; Current Rating: 300mA; Pitch: 0.4mm; Connector Type: Plug; Lead Free: Lead Free; Number of Positions: 40; Packaging: Tape and Reel; Contact Plating: Gold; REACH SVHC: No SVHC; Mount: Surface Mount; Orientation: Straight; Housing Material: Polymer; Termination: SMD/SMT; Min Operating Temperature: -35°C; Number of Rows: 2; Max Operating Temperature: 85°C; Contact Material: Bronze; Package Quantity: 1
J5 = 505066-1222: Connector; Manufacturer_Name: Molex; Datasheet Link: https://www.molex.com/pdm_docs/sd/5050661222_sd.pdf; Height: 0.63mm; Manufacturer_Part_Number: 505066-1222; Mouser Part Number: 538-505066-1222; Mouser Price/Stock: https://www.mouser.co.uk/ProductDetail/Molex/505066-1222?qs=byeeYqUIh0OlQo7UKX%2FsWw%3D%3D
J8 = DF52-2S-0.8H_21_: Connector; Manufacturer_Name: Hirose; Datasheet Link: https://datasheet.datasheetarchive.com/originals/distributors/DKDS-30/591726.pdf; Height: 1mm; Manufacturer_Part_Number: DF52-2S-0.8H(21); Mouser Part Number: 798-DF52-2S-0.8H21; Mouser Price/Stock: https://www.mouser.co.uk/ProductDetail/Hirose-Connector/DF52-2S-0.8H21?qs=%2FKR40Cd6GUpAHUMGMtWbig%3D%3D
R16 = RES DNM: Resistor; Value: DNM
R35 R44-R48 = CMP-2004-00655-1: Manufacturer: Vishay Dale; Part Number: CRCW020149R9FNED
U19 = PESD1USB30: ESD Suppressor Diode TVS Uni-Dir 5V 5-Pin WLCSP T/R; Manufacturer: NXP Semiconductors; Manufacturer Part Number: PESD1USB30; Supplier 1: Mouser; Supplier Part Number 1: 771-PESD1USB30Z

## Sheet 11_BREAK_OFF.SchDoc: SENSEI Base Board - Breakoff
size A3; DrawnBy: Sebastian Frey; Organization: Integrated Systems Laboratory; DocumentNumber: 12; Revision: v1.1; SheetNumber: 12; SheetTotal: 12
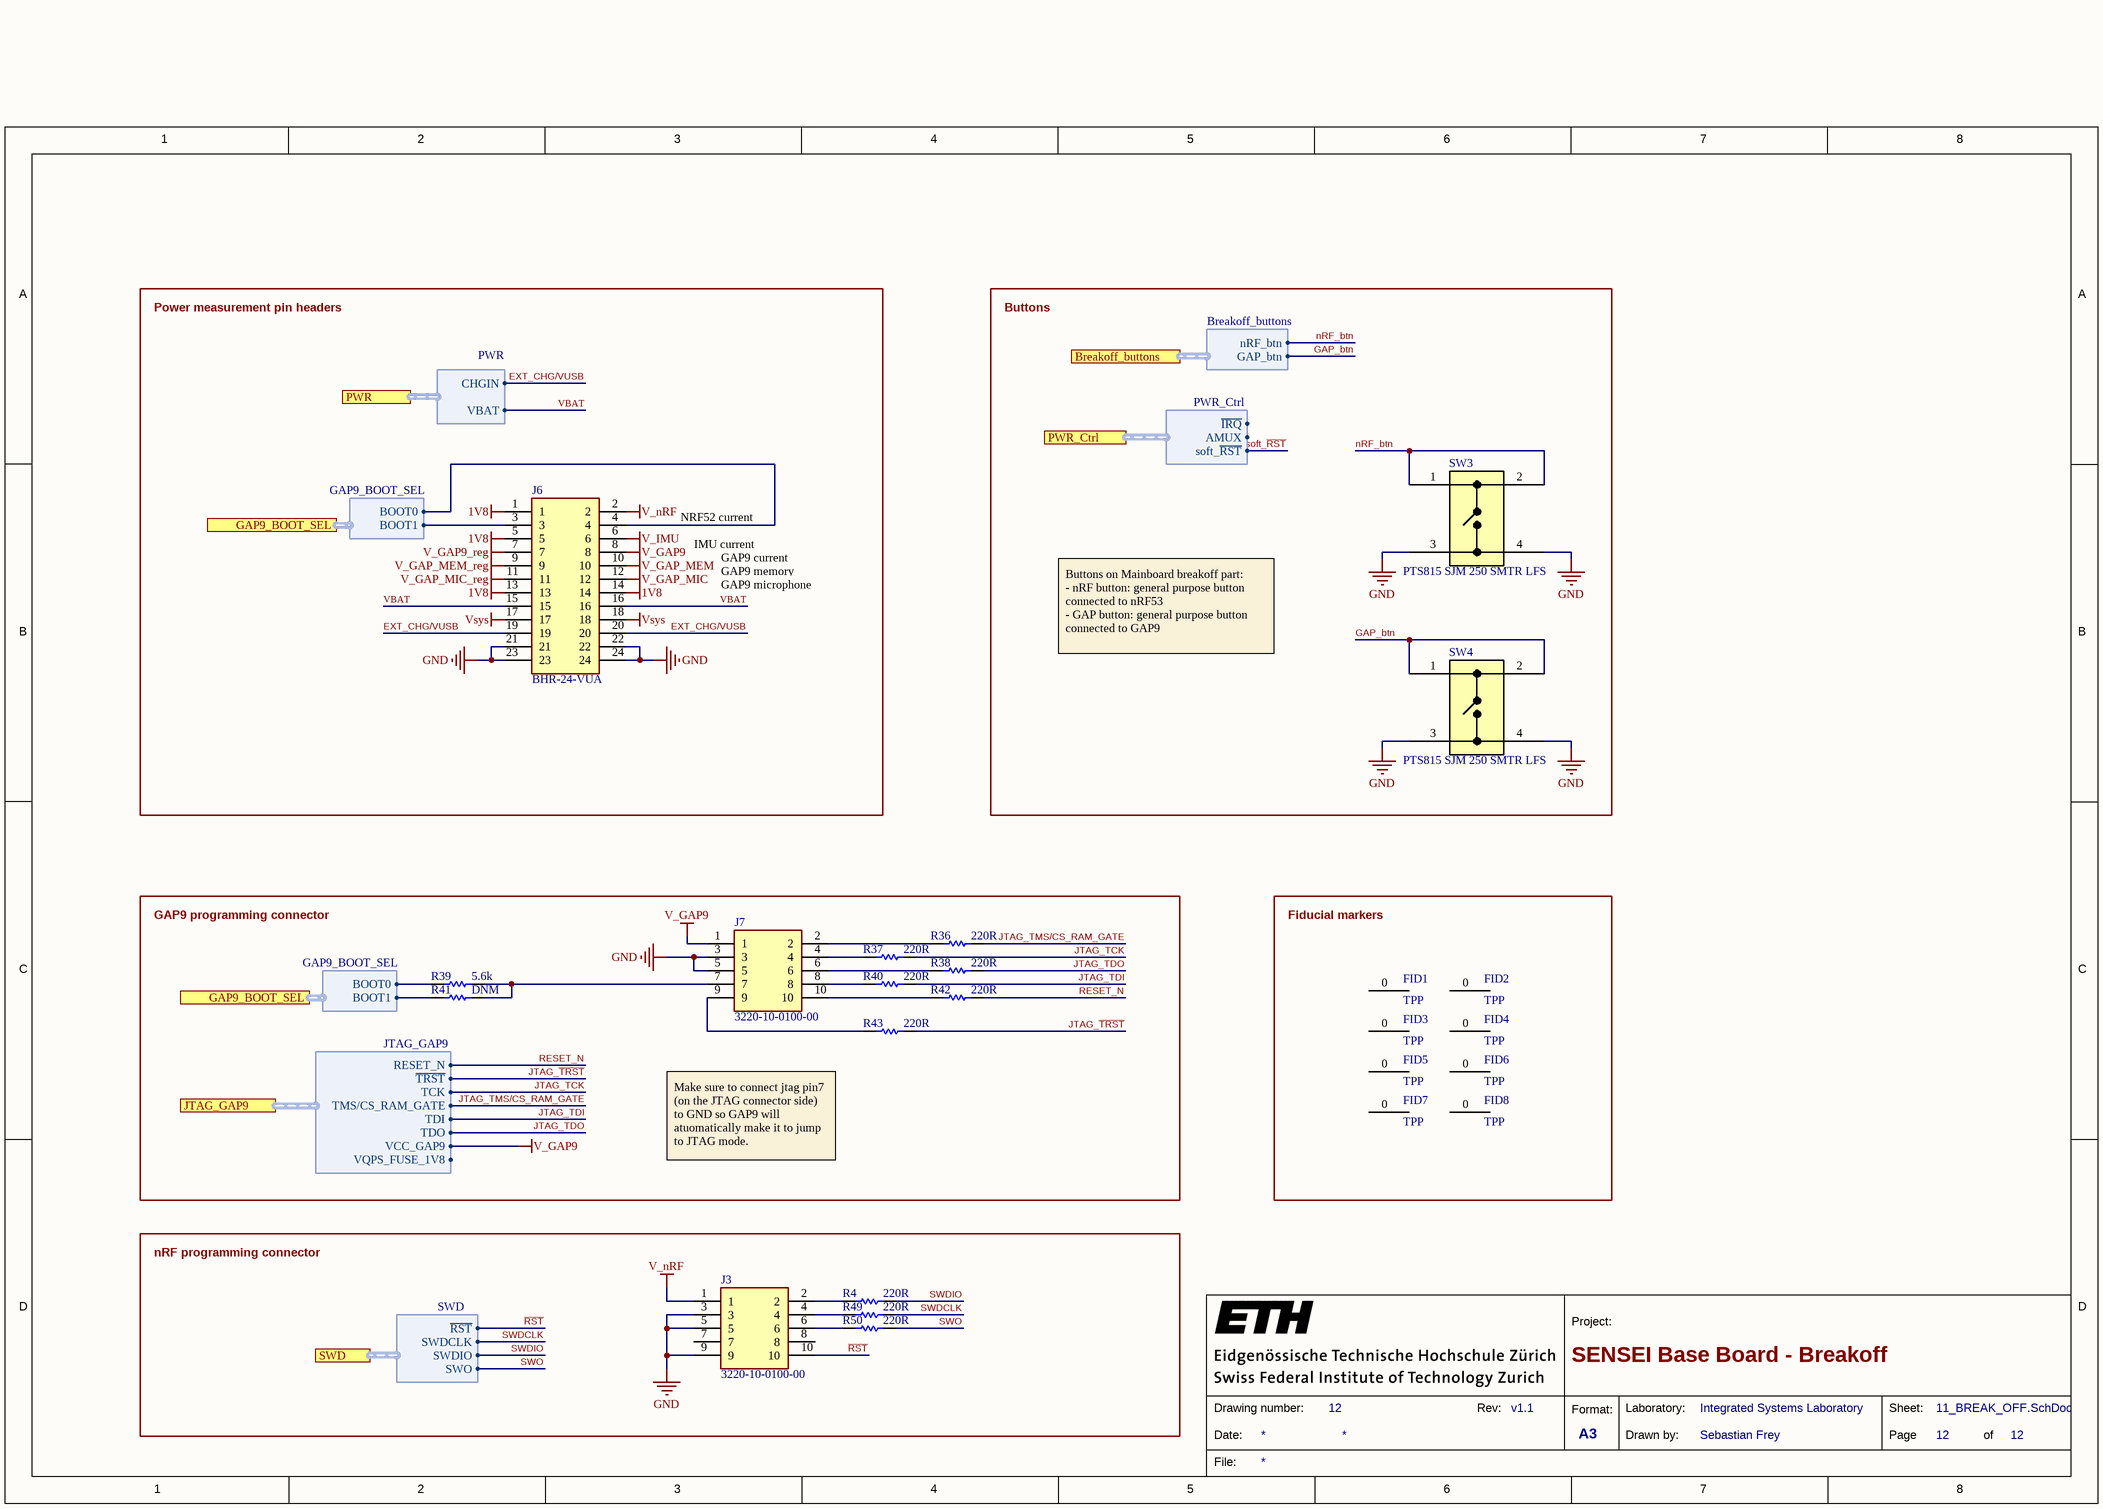
[diagram p11: 11_BREAK_OFF.SchDoc]

### Parts
(Parts that share a designator on the sheet are numbered #1, #2 ... from top to bottom, then left to right.)
FID1  TPP  [TPP]
FID2  TPP  [TPP]
FID3  TPP  [TPP]
FID4  TPP  [TPP]
FID5  TPP  [TPP]
FID6  TPP  [TPP]
FID7  TPP  [TPP]
FID8  TPP  [TPP]
J3  3220-10-0100-00  [322010010000]
J6  BHR-24-VUA  [SHDR24W64P254_2X12_3808X880X910P]
J7  3220-10-0100-00  [322010010000]
R4#2  value 220R  [RESC0603X28X15NL05T05]  (hidden comment: CRCW0201220RFKED)
R36  value 220R  [RESC0603X28X15NL05T05]  (hidden comment: CRCW0201220RFKED)
R37  value 220R  [RESC0603X28X15NL05T05]  (hidden comment: CRCW0201220RFKED)
R38  value 220R  [RESC0603X28X15NL05T05]  (hidden comment: CRCW0201220RFKED)
R39  Resistance: 5.6k  [RESC1608X55X30ML20T10]  (hidden comment: RK73B1JTTD562J)
R40  value 220R  [RESC0603X28X15NL05T05]  (hidden comment: CRCW0201220RFKED)
R41  DNM  [RESC1608X55X30ML20T10]
R42  value 220R  [RESC0603X28X15NL05T05]  (hidden comment: CRCW0201220RFKED)
R43  value 220R  [RESC0603X28X15NL05T05]  (hidden comment: CRCW0201220RFKED)
R49  value 220R  [RESC0603X28X15NL05T05]  (hidden comment: CRCW0201220RFKED)
R50  value 220R  [RESC0603X28X15NL05T05]  (hidden comment: CRCW0201220RFKED)
SW3  PTS815 SJM 250 SMTR LFS  [SW4_PTS815 SJM 250 SMTR LFS_CNK]
SW4  PTS815 SJM 250 SMTR LFS  [SW4_PTS815 SJM 250 SMTR LFS_CNK]

### Blocks framed on the sheet
Power measurement pin headers: J6
Buttons: SW3 SW4
GAP9 programming connector: J7 R36-R43
Fiducial markers: FID1-FID8
nRF programming connector: J3 R4#2 R49 R50

### Ports
Breakoff_buttons (harness Breakoff_buttons), GAP9_BOOT_SEL (harness GAP9_BOOT_SEL), JTAG_GAP9 (harness JTAG_GAP9), PWR (harness PWR), PWR_Ctrl (harness PWR_Ctrl), SWD (harness SWD)

### Harnesses
PWR: CHGIN, VBAT
GAP9_BOOT_SEL: BOOT0, BOOT1
Breakoff_buttons: nRF_btn, GAP_btn
JTAG_GAP9: ~{TRST}, TCK, TMS/CS_RAM_GATE, TDI, TDO, VCC_GAP9, RESET_N, VQPS_FUSE_1V8
SWD: ~{RST}, SWDIO, SWDCLK, SWO
PWR_Ctrl: ~{IRQ}, AMUX, soft_~{RST}

### Nets
1V8: J6.1 J6.5 J6.13 J6.14
GND: J3.3 J3.5 J3.9 J6.21 J6.22 J6.23 J6.24 J7.3 J7.5 SW3.3 SW3.4 SW4.3 SW4.4
V_GAP9: J6.8 J7.1 ; port JTAG_GAP9.VCC_GAP9
V_GAP9_reg: J6.7
V_GAP_MEM: J6.10
V_GAP_MEM_reg: J6.9
V_GAP_MIC: J6.12
V_GAP_MIC_reg: J6.11
V_IMU: J6.6
V_nRF: J3.1 J6.2
Vsys: J6.17 J6.18
EXT_CHG/VUSB: J6.19 J6.20 ; port PWR.CHGIN
GAP_btn: SW4.1 SW4.2 ; port Breakoff_buttons.GAP_btn
JTAG_~{TRST}: R43.2 ; port JTAG_GAP9.~{TRST}
JTAG_TCK: R37.2 ; port JTAG_GAP9.TCK
JTAG_TDI: R40.2 ; port JTAG_GAP9.TDI
JTAG_TDO: R38.2 ; port JTAG_GAP9.TDO
JTAG_TMS/CS_RAM_GATE: R36.2 ; port JTAG_GAP9.TMS/CS_RAM_GATE
nRF_btn: SW3.1 SW3.2 ; port Breakoff_buttons.nRF_btn
~{RST}: J3.10 ; port SWD.~{RST}
RESET_N: R42.2 ; port JTAG_GAP9.RESET_N
SPI_B_CLK_GAP: J6.4 R39.1 ; port GAP9_BOOT_SEL.BOOT0
SPI_B_MISO_GAP: J6.3 R41.1 ; port GAP9_BOOT_SEL.BOOT1
SWDCLK: R49.2 ; port SWD.SWDCLK
SWDIO: R4#2.2 ; port SWD.SWDIO
SWO: R50.2 ; port SWD.SWO
VBAT: J6.15 J6.16 ; port PWR.VBAT
NetJ3_2: J3.2 R4#2.1
NetJ3_4: J3.4 R49.1
NetJ3_6: J3.6 R50.1
NetJ7_2: J7.2 R36.1
NetJ7_4: J7.4 R37.1
NetJ7_6: J7.6 R38.1
NetJ7_7: J7.7 R39.2 R41.2
NetJ7_8: J7.8 R40.1
NetJ7_9: J7.9 R43.1
NetJ7_10: J7.10 R42.1

Not connected (* = marked no-connect by the designer): FID1 0(2); FID2 0(2); FID3 0(2); FID4 0(2); FID5 0(2); FID6 0(2); FID7 0(2); FID8 0(2); J3 7 8

### Notes on the sheet
- NRF52 current
- IMU current
- GAP9 current
- GAP9 memory current
- GAP9 microphone current
- Buttons on Mainboard breakoff part:
  - nRF button: general purpose button connected to nRF53
  - GAP button: general purpose button connected to GAP9
- Make sure to connect jtag pin7  (on the JTAG connector side) to GND so GAP9 will atuomatically make it to jump to JTAG mode.
- 1
- 2
- 3
- 4
- 5
- 6
- 7
- 8
- A
- B
- C
- D
- Project:
- Date:
- Drawing number:
- Rev:
- Format:
- A3
- Drawn by:
- Laboratory:
- Page
- Sheet:
- of
- File:

### Library data of the parts
J3 J7 = 3220-10-0100-00: Connector; Manufacturer_Name: CNC Tech; Datasheet Link: https://datasheet.datasheetarchive.com/originals/dk/DKDS-7/133059.pdf; Height: 5.6mm; Manufacturer_Part_Number: 3220-10-0100-00; Arrow Part Number: 3220-10-0100-00; Arrow Price/Stock: https://www.arrow.com/en/products/3220-10-0100-00/cnc-tech-llc?region=nac
J6 = BHR-24-VUA: Connector; Manufacturer_Name: Adam Tech; Datasheet Link: https://datasheet.datasheetarchive.com/originals/distributors/Datasheets_SAMA/695a8166aa40898d0a6b5857fa89f6fe.pdf; Height: 9.1mm; Manufacturer_Part_Number: BHR-24-VUA; Arrow Part Number: BHR-24-VUA; Arrow Price/Stock: https://www.arrow.com/en/products/bhr-24-vua/adam-tech
R4#2 R36-R38 R40 R42 R43 R49 R50 = CMP-2004-00982-1: Manufacturer: Vishay Dale; Part Number: CRCW0201220RFKED
R39 = CMP-2000-01007-1: Manufacturer: KOA Speer; Part Number: RK73B1JTTD562J
R41 = CMP-2000-01007-1: Part Number: RK73B1JTTD562J; Manufacturer: KOA Speer; Resistance: DNM
SW3 SW4 = PTS815 SJM 250 SMTR LFS: No Description Available; Mfr_Name: C&K Components; Copyright: Copyright (C) 2023 Ultra Librarian. All rights reserved.; Manufacturer_Part_Number: PTS815 SJM 250 SMTR LFS; RefDes: RefDes; Type: DEV